# EAGLE board scoutfly_atmel (EAGLE 5.06), part 1 of 3
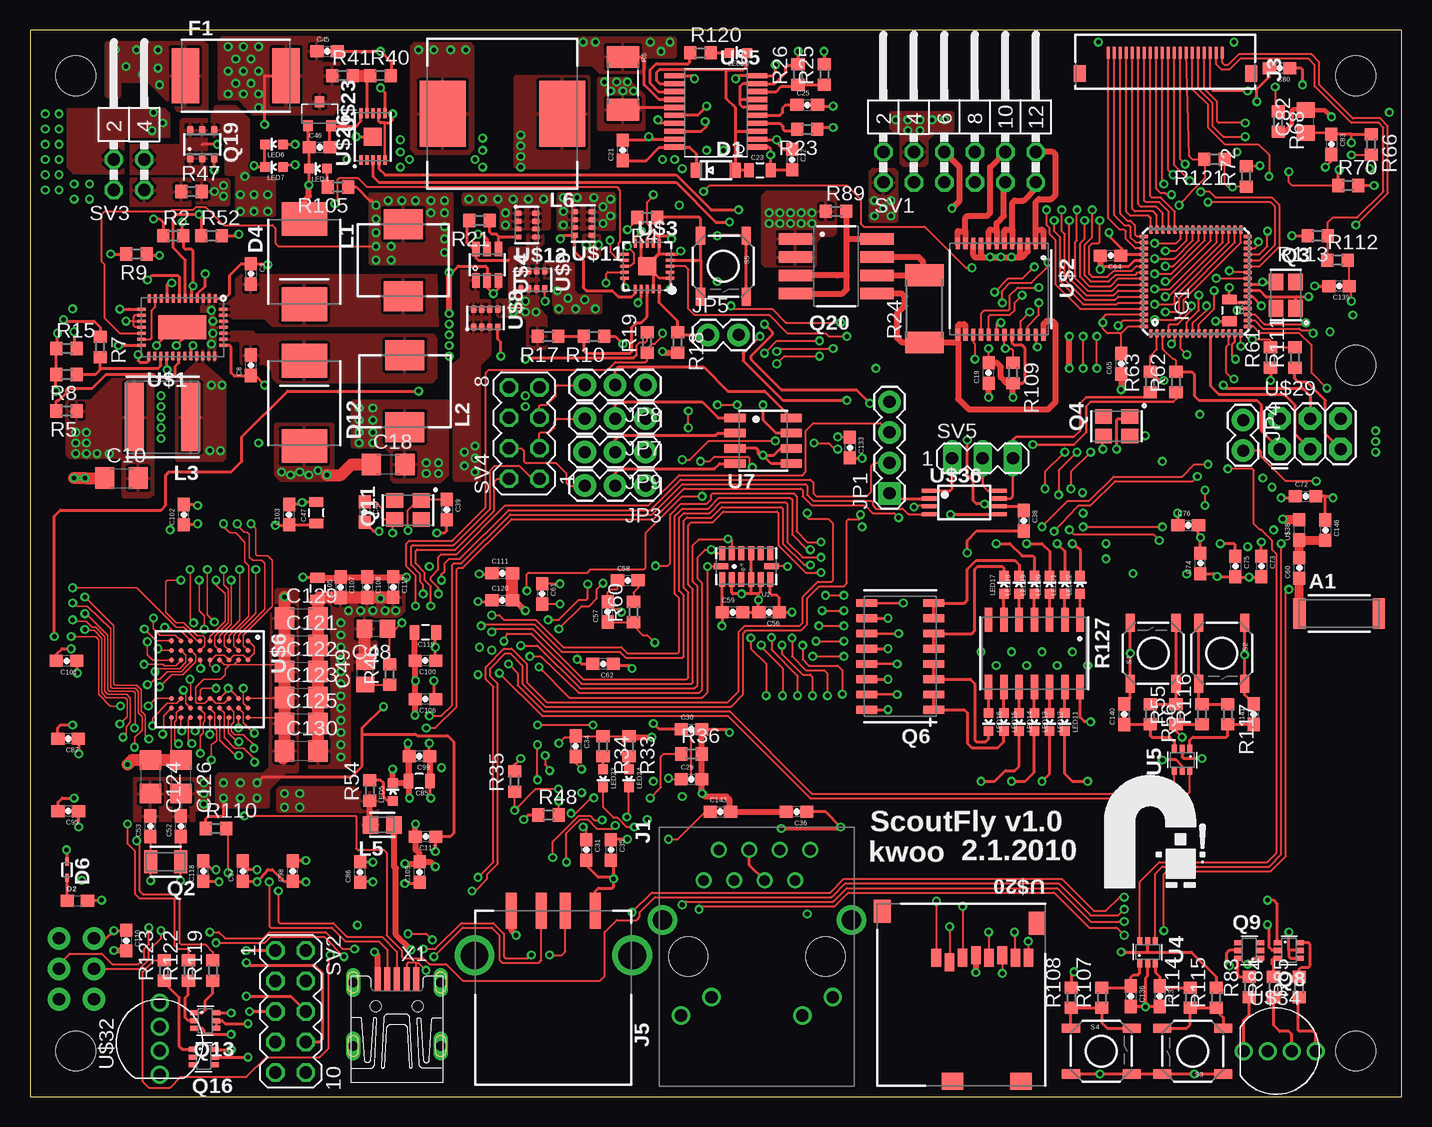
[diagram p7: board, top side]
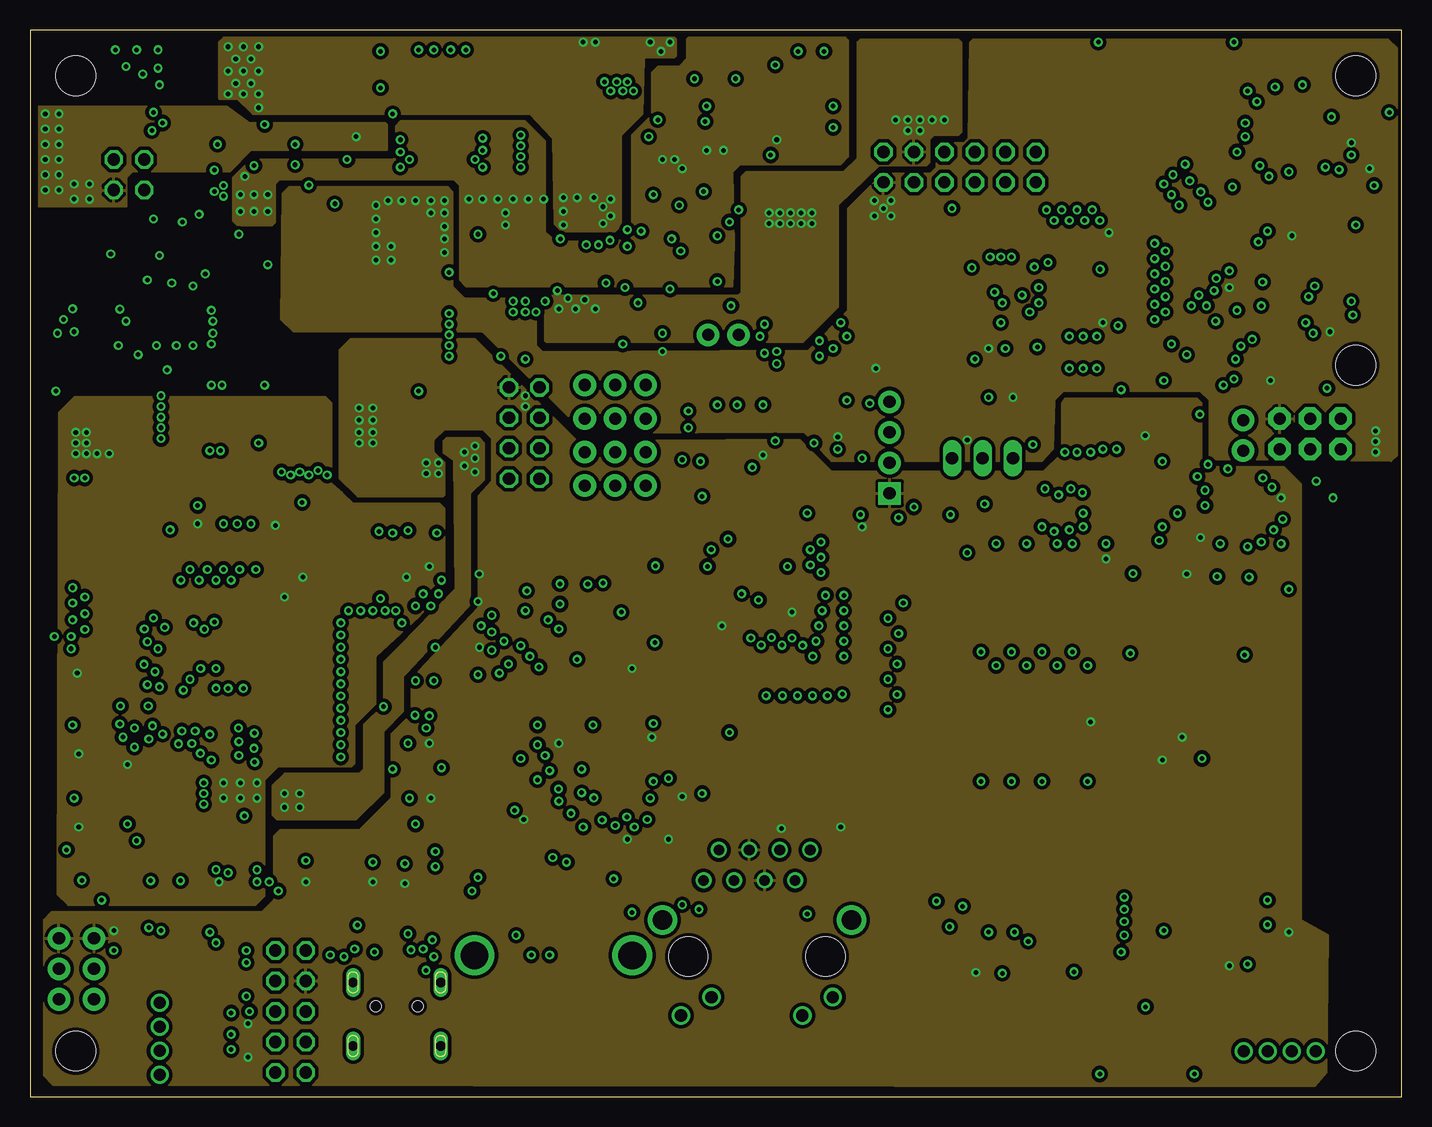
[diagram p8: board, inner layer Power]
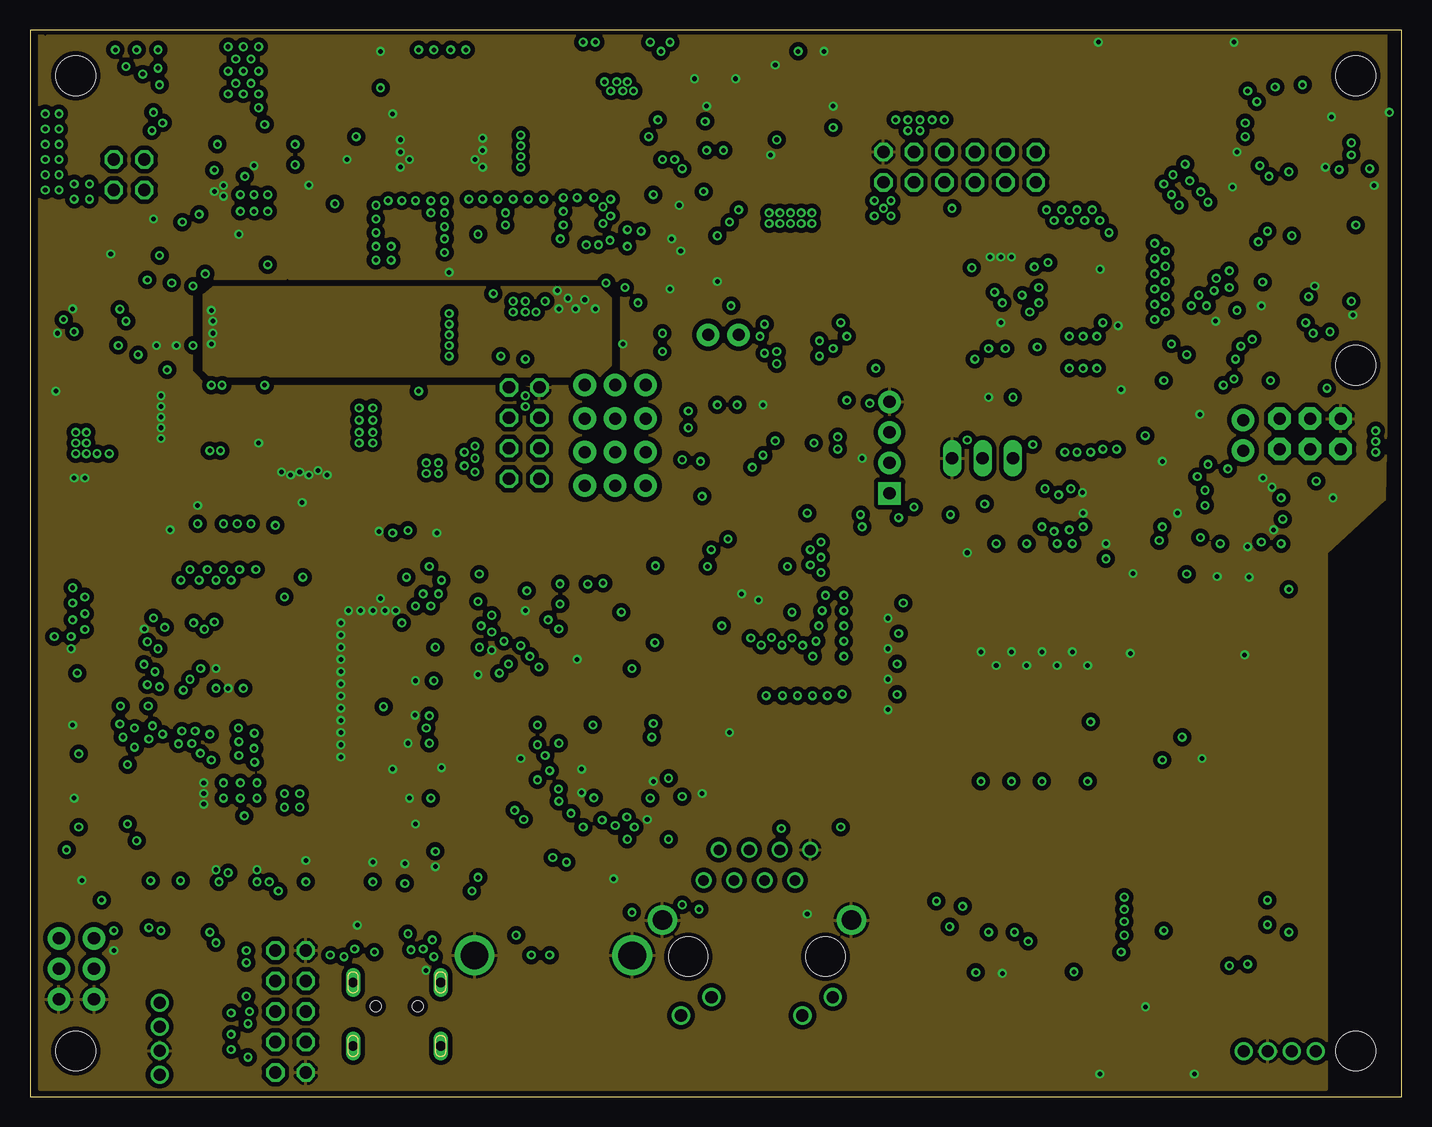
[diagram p9: board, inner layer GND]
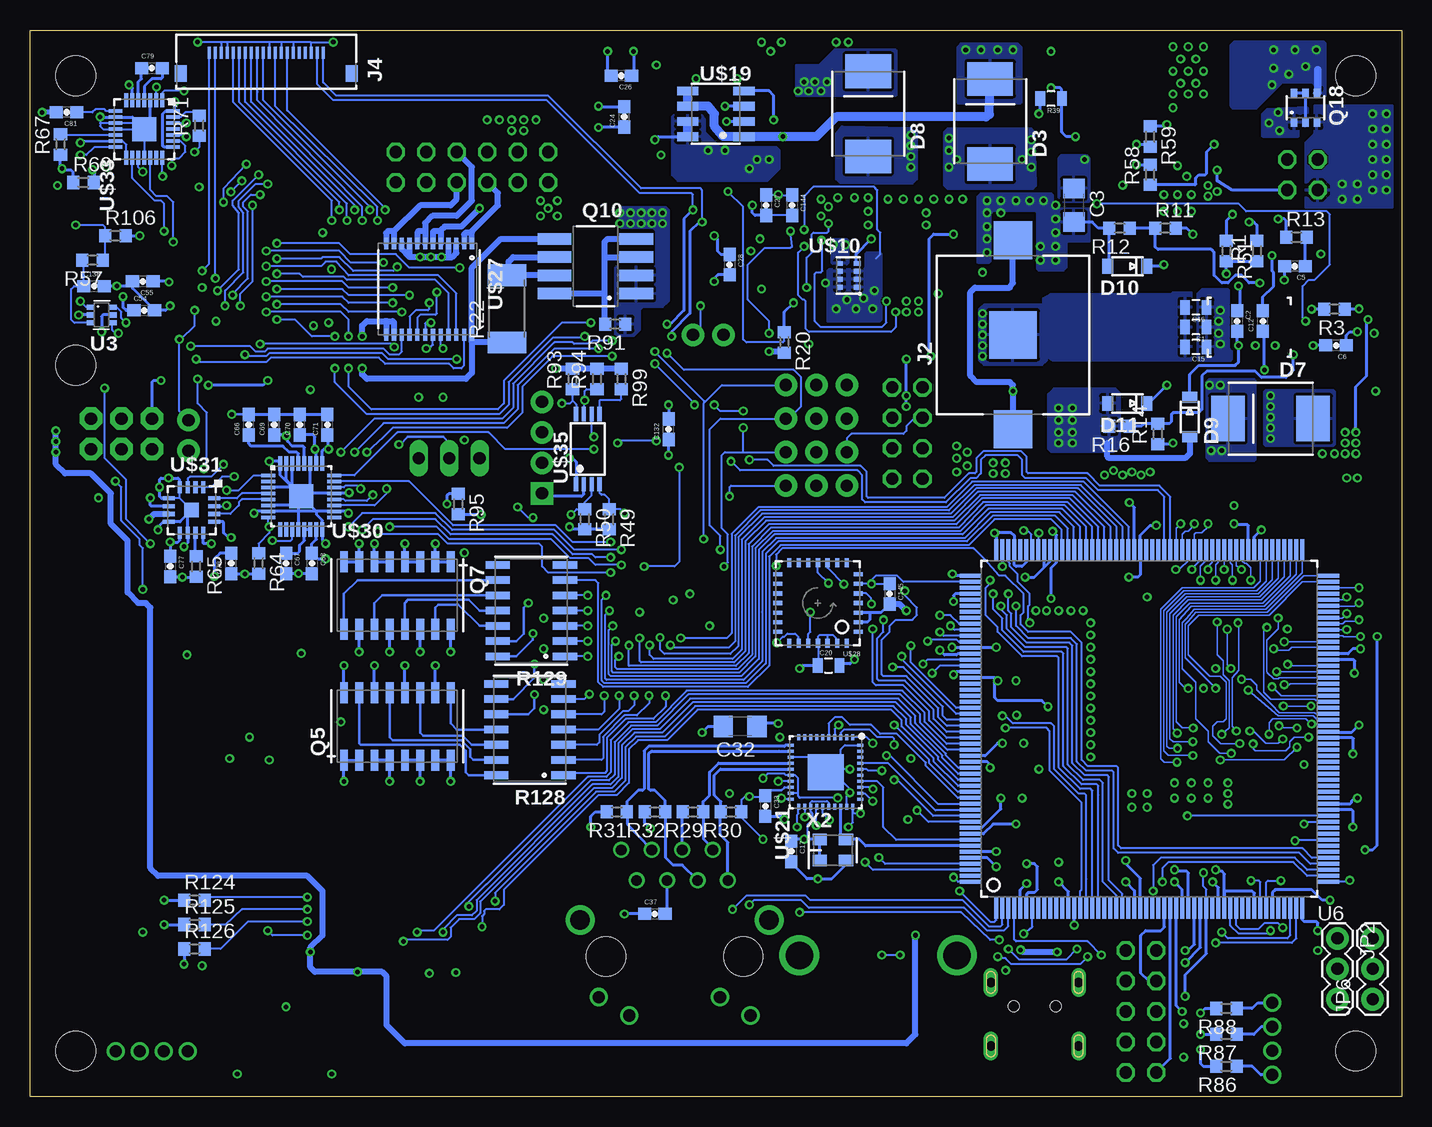
[diagram p10: board, bottom side, seen from below]

Size 114.3 x 88.9 mm. Coordinates in mm from the lower left corner, seen from the top.
Outline: 0,0 114.3,0 114.3,88.9 0,88.9 0,0
Copper layers (1*2+15*16): Top 0.035mm / dielectric 1.5mm / Power 0.035mm / dielectric 0.15mm / GND 0.035mm / dielectric 0.2mm / Bottom 0.035mm
Design rules "advanced_5 *": minimum track width 5mil, minimum drill 15mil, track to track 5mil, track to pad 5mil, pad to pad 5mil, via to via 5mil, smd to smd 5mil, copper to edge 10mil, drill to drill 8mil, minimum pad ring 7mil, minimum via ring 7mil, stop-mask expansion 4mil, vias tented up to drill 0mil, thermal gap 10mil

## Footprints (pad centres in the part's own frame; a part is rotated, then mirrored left to right if it is on the bottom)
CHIP_ANT_2.4GHZ = smd 1.016 x 2.54: 1 -3.302,0; 2 3.302,0
0805 = smd 0.8 x 1.2: 1 -0.9,0; 2 0.9,0
0603-CAP = smd 1.1 x 1: 1 -0.85,0; 2 0.85,0
C1206 = smd 1.6 x 1.8: 1 -1.4,0; 2 1.4,0
C0805 = smd 1.3 x 1.5: 1 -0.95,0; 2 0.95,0
SOD-123 = smd 0.914 x 1.219: 1 -1.638,0; 2 1.638,0
0603 = smd 1.1 x 1: 1 -0.85,0; 2 0.85,0
SMC/DO-214AB = smd 2.8 x 3.8: 1 -3.55,0; 2 3.55,0
SOD523 = smd 0.65 x 0.3: 1 -0.675,0; 2 0.675,0
SM200 = smd 2.3 x 4.6: 1 -4.2,0; 2 4.2,0
MLF64 = smd 0.7 x 0.3: 1 -4.325,3.75; 2 -4.325,3.25; 3 -4.325,2.75; 4 -4.325,2.25; 5 -4.325,1.75; 6 -4.325,1.25; 7 -4.325,0.75; 8 -4.325,0.25; 9 -4.325,-0.25; 10 -4.325,-0.75; 11 -4.325,-1.25; 12 -4.325,-1.75; 13 -4.325,-2.25; 14 -4.325,-2.75; 15 -4.325,-3.25; 16 -4.325,-3.75; 33 4.325,-3.75; 34 4.325,-3.25; 35 4.325,-2.75; 36 4.325,-2.25; 37 4.325,-1.75; 38 4.325,-1.25; 39 4.325,-0.75; 40 4.325,-0.25; 41 4.325,0.25; 42 4.325,0.75; 43 4.325,1.25; 44 4.325,1.75; 45 4.325,2.25; 46 4.325,2.75; 47 4.325,3.25; 48 4.325,3.75 | smd 0.3 x 0.7: 17 -3.75,-4.325; 18 -3.25,-4.325; 19 -2.75,-4.325; 20 -2.25,-4.325; 21 -1.75,-4.325; 22 -1.25,-4.325; 23 -0.75,-4.325; 24 -0.25,-4.325; 25 0.25,-4.325; 26 0.75,-4.325; 27 1.25,-4.325; 28 1.75,-4.325; 29 2.25,-4.325; 30 2.75,-4.325; 31 3.25,-4.325; 32 3.75,-4.325; 49 3.75,4.325; 50 3.25,4.325; 51 2.75,4.325; 52 2.25,4.325; 53 1.75,4.325; 54 1.25,4.325; 55 0.75,4.325; 56 0.25,4.325; 57 -0.25,4.325; 58 -0.75,4.325; 59 -1.25,4.325; 60 -1.75,4.325; 61 -2.25,4.325; 62 -2.75,4.325; 63 -3.25,4.325; 64 -3.75,4.325
RJ45-PULSE = drill 0.889 round: 1 4.445,-6.35; 2 3.175,-8.89; 3 1.905,-6.35; 4 0.635,-8.89; 5 -0.635,-6.35; 6 -1.905,-8.89; 7 -3.175,-6.35; 8 -4.445,-8.89 | drill 1.016 round: 9 6.325,4.902; 10 3.785,3.378; 11 -3.785,4.902; 12 -6.325,3.378 | drill 1.626 round: SHIELD1 -7.874,-3.048; SHIELD2 7.874,-3.048 | hole 3.251: 5.715,0; -5.715,0
COIN_CELL = smd 3.962 x 3.962: NEGATIVE 0,0 | smd 3.175 x 3.175: PLUS1 -7.874,0; PLUS2 7.874,0
OMRON_XF = smd 0.25 x 1: 1 -4.75,0; 2 -4.25,0; 3 -3.75,0; 4 -3.25,0; 5 -2.75,0; 6 -2.25,0; 7 -1.75,0; 8 -1.25,0; 9 -0.75,0; 10 -0.25,0; 11 0.25,0; 12 0.75,0; 13 1.25,0; 14 1.75,0; 15 2.25,0; 16 2.75,0; 17 3.25,0; 18 3.75,0; 19 4.25,0; 20 4.75,0 | smd 1 x 1.34: SOLDER_PAD1 -7.14,-1.72; SOLDER_PAD2 7.14,-1.72
USB_A = smd 0.9 x 3: 1 -3.5,0; 2 -1,0; 3 1,0; 4 3.5,0 | drill 2.3 round: CASE1 -6.57,-3.71; CASE2 6.57,-3.71
1X04 = drill 1.016 pad 1.88 square: 1 0,0 | drill 1.016 pad 1.88 round: 2 2.54,0; 3 5.08,0; 4 7.62,0
1X03 = drill 1.016 pad 1.88 round: 1 0,0; 2 2.54,0; 3 5.08,0
1X02 = drill 1.016 pad 1.88 round: 1 0,0; 2 2.54,0
STAND-OFF = hole 3.302: 0,0
DR74 = smd 2.5 x 3.25: 1 -3,0; 2 3,0
NR6045 = smd 1.6 x 5.7: 1 -2.35,0; 2 2.35,0
0805' = smd 1.285 x 1.47: 1 -0.973,0; 2 0.973,0
DR125 = smd 3.85 x 5.5: 1 -4.975,0; 2 4.975,0
LED-0603 = smd 0.8 x 0.8: A 0,-0.75; C 0,0.75
ECX-31B = smd 1.1 x 1.9: 1 -1.25,0; 2 1.25,0
NX3225SA = smd 1.4 x 1.2: 1 -1.1,-0.8; 2 1.1,-0.8; 3 1.1,0.8; 4 -1.1,0.8
16-SOIC = smd 0.65 x 1.75: 1 -4.445,-2.8; 2 -3.175,-2.8; 3 -1.905,-2.8; 4 -0.635,-2.8; 5 0.635,-2.8; 6 1.905,-2.8; 7 3.175,-2.8; 8 4.445,-2.8; 9 4.445,2.8; 10 3.175,2.8; 11 1.905,2.8; 12 0.635,2.8; 13 -0.635,2.8; 14 -1.905,2.8; 15 -3.175,2.8; 16 -4.445,2.8
SOT363 = smd 0.42 x 0.6: 1 -0.65,-0.95; 2 0,-0.95; 3 0.65,-0.95; 4 0.65,0.95; 5 0,0.95; 6 -0.65,0.95
SOT223-8 = smd 0.95 x 2.8: 1 -2.28,-3.4; 2 -0.76,-3.4; 3 0.76,-3.4; 4 2.28,-3.4; 5 2.28,3.4; 6 0.76,3.4; 7 -0.76,3.4; 8 -2.28,3.4
SOT26 = smd 0.55 x 0.8: 1 -0.95,-1.2; 2 0,-1.2; 3 0.95,-1.2; 4 0.95,1.2; 5 0,1.2; 6 -0.95,1.2
6-TSOP = smd 0.508 x 0.699: 1 -1.001,-1.163; 2 0,-1.163; 3 1.001,-1.163; 4 1.001,1.163; 5 0,1.163; 6 -1.001,1.163
R0603 = smd 1 x 1.1: 1 -0.85,0; 2 0.85,0
R2010 = smd 1.8 x 2.7: 1 -2.2,0; 2 2.2,0
R2512 = smd 1.8 x 3.2: 1 -2.8,0; 2 2.8,0
14-SOIC_CTS = smd 2.03 x 0.63: 1 -2.8,3.81; 2 -2.8,2.54; 3 -2.8,1.27; 4 -2.8,0; 5 -2.8,-1.27; 6 -2.8,-2.54; 7 -2.8,-3.81; 8 2.8,-3.81; 9 2.8,-2.54; 10 2.8,-1.27; 11 2.8,0; 12 2.8,1.27; 13 2.8,2.54; 14 2.8,3.81
TACTILE_SWITCH_SMD = smd 1.524 x 0.762: 1 -2.54,1.905; 2 2.54,1.905; 3 -2.54,-1.905; 4 2.54,-1.905
MA06-2W = drill 1.016 octagon: 1 -7.62,-1.27; 2 -7.62,1.27; 3 -5.08,-1.27; 4 -5.08,1.27; 5 -2.54,-1.27; 6 -2.54,1.27; 7 0,-1.27; 8 0,1.27; 9 2.54,-1.27; 10 2.54,1.27; 11 5.08,-1.27; 12 5.08,1.27
MA05-2 = drill 1.016 octagon: 1 -5.08,-1.27; 2 -5.08,1.27; 3 -2.54,-1.27; 4 -2.54,1.27; 5 0,-1.27; 6 0,1.27; 7 2.54,-1.27; 8 2.54,1.27; 9 5.08,-1.27; 10 5.08,1.27
MA02-2W = drill 1.016 octagon: 1 -1.27,-5.08; 2 -1.27,-2.54; 3 1.27,-5.08; 4 1.27,-2.54
MA04-2 = drill 1.016 octagon: 1 -3.81,-1.27; 2 -3.81,1.27; 3 -1.27,-1.27; 4 -1.27,1.27; 5 1.27,-1.27; 6 1.27,1.27; 7 3.81,-1.27; 8 3.81,1.27
MA03-1 = drill 1.016 long: 1 -2.54,0; 2 0,0; 3 2.54,0
LGA14 = smd 0.5 x 1.2: 1 2,1.1; 2 1.2,1.1; 3 0.4,1.1; 4 -0.4,1.1; 5 -1.2,1.1; 6 -2,1.1; 8 -2,-1.1; 9 -1.2,-1.1; 10 -0.4,-1.1; 11 0.4,-1.1; 12 1.2,-1.1; 13 2,-1.1 | smd 1.2 x 0.5: 7 -2.1,0; 14 2.1,0
208-PQFP = smd 0.35 x 1.77: 1 -12.75,-14.925; 2 -12.25,-14.925; 3 -11.75,-14.925; 4 -11.25,-14.925; 5 -10.75,-14.925; 6 -10.25,-14.925; 7 -9.75,-14.925; 8 -9.25,-14.925; 9 -8.75,-14.925; 10 -8.25,-14.925; 11 -7.75,-14.925; 12 -7.25,-14.925; 13 -6.75,-14.925; 14 -6.25,-14.925; 15 -5.75,-14.925; 16 -5.25,-14.925; 17 -4.75,-14.925; 18 -4.25,-14.925; 19 -3.75,-14.925; 20 -3.25,-14.925; 21 -2.75,-14.925; 22 -2.25,-14.925; 23 -1.75,-14.925; 24 -1.25,-14.925; 25 -0.75,-14.925; 26 -0.25,-14.925; 27 0.25,-14.925; 28 0.75,-14.925; 29 1.25,-14.925; 30 1.75,-14.925; 31 2.25,-14.925; 32 2.75,-14.925; 33 3.25,-14.925; 34 3.75,-14.925; 35 4.25,-14.925; 36 4.75,-14.925; 37 5.25,-14.925; 38 5.75,-14.925; 39 6.25,-14.925; 40 6.75,-14.925; 41 7.25,-14.925; 42 7.75,-14.925; 43 8.25,-14.925; 44 8.75,-14.925; 45 9.25,-14.925; 46 9.75,-14.925; 47 10.25,-14.925; 48 10.75,-14.925; 49 11.25,-14.925; 50 11.75,-14.925; 51 12.25,-14.925; 52 12.75,-14.925; 105 12.75,14.925; 106 12.25,14.925; 107 11.75,14.925; 108 11.25,14.925; 109 10.75,14.925; 110 10.25,14.925; 111 9.75,14.925; 112 9.25,14.925; 113 8.75,14.925; 114 8.25,14.925; 115 7.75,14.925; 116 7.25,14.925; 117 6.75,14.925; 118 6.25,14.925; 119 5.75,14.925; 120 5.25,14.925; 121 4.75,14.925; 122 4.25,14.925; 123 3.75,14.925; 124 3.25,14.925; 125 2.75,14.925; 126 2.25,14.925; 127 1.75,14.925; 128 1.25,14.925; 129 0.75,14.925; 130 0.25,14.925; 131 -0.25,14.925; 132 -0.75,14.925; 133 -1.25,14.925; 134 -1.75,14.925; 135 -2.25,14.925; 136 -2.75,14.925; 137 -3.25,14.925; 138 -3.75,14.925; 139 -4.25,14.925; 140 -4.75,14.925; 141 -5.25,14.925; 142 -5.75,14.925; 143 -6.25,14.925; 144 -6.75,14.925; 145 -7.25,14.925; 146 -7.75,14.925; 147 -8.25,14.925; 148 -8.75,14.925; 149 -9.25,14.925; 150 -9.75,14.925; 151 -10.25,14.925; 152 -10.75,14.925; 153 -11.25,14.925; 154 -11.75,14.925; 155 -12.25,14.925; 156 -12.75,14.925 | smd 1.77 x 0.35: 53 14.925,-12.75; 54 14.925,-12.25; 55 14.925,-11.75; 56 14.925,-11.25; 57 14.925,-10.75; 58 14.925,-10.25; 59 14.925,-9.75; 60 14.925,-9.25; 61 14.925,-8.75; 62 14.925,-8.25; 63 14.925,-7.75; 64 14.925,-7.25; 65 14.925,-6.75; 66 14.925,-6.25; 67 14.925,-5.75; 68 14.925,-5.25; 69 14.925,-4.75; 70 14.925,-4.25; 71 14.925,-3.75; 72 14.925,-3.25; 73 14.925,-2.75; 74 14.925,-2.25; 75 14.925,-1.75; 76 14.925,-1.25; 77 14.925,-0.75; 78 14.925,-0.25; 79 14.925,0.25; 80 14.925,0.75; 81 14.925,1.25; 82 14.925,1.75; 83 14.925,2.25; 84 14.925,2.75; 85 14.925,3.25; 86 14.925,3.75; 87 14.925,4.25; 88 14.925,4.75; 89 14.925,5.25; 90 14.925,5.75; 91 14.925,6.25; 92 14.925,6.75; 93 14.925,7.25; 94 14.925,7.75; 95 14.925,8.25; 96 14.925,8.75; 97 14.925,9.25; 98 14.925,9.75; 99 14.925,10.25; 100 14.925,10.75; 101 14.925,11.25; 102 14.925,11.75; 103 14.925,12.25; 104 14.925,12.75; 157 -14.925,12.75; 158 -14.925,12.25; 159 -14.925,11.75; 160 -14.925,11.25; 161 -14.925,10.75; 162 -14.925,10.25; 163 -14.925,9.75; 164 -14.925,9.25; 165 -14.925,8.75; 166 -14.925,8.25; 167 -14.925,7.75; 168 -14.925,7.25; 169 -14.925,6.75; 170 -14.925,6.25; 171 -14.925,5.75; 172 -14.925,5.25; 173 -14.925,4.75; 174 -14.925,4.25; 175 -14.925,3.75; 176 -14.925,3.25; 177 -14.925,2.75; 178 -14.925,2.25; 179 -14.925,1.75; 180 -14.925,1.25; 181 -14.925,0.75; 182 -14.925,0.25; 183 -14.925,-0.25; 184 -14.925,-0.75; 185 -14.925,-1.25; 186 -14.925,-1.75; 187 -14.925,-2.25; 188 -14.925,-2.75; 189 -14.925,-3.25; 190 -14.925,-3.75; 191 -14.925,-4.25; 192 -14.925,-4.75; 193 -14.925,-5.25; 194 -14.925,-5.75; 195 -14.925,-6.25; 196 -14.925,-6.75; 197 -14.925,-7.25; 198 -14.925,-7.75; 199 -14.925,-8.25; 200 -14.925,-8.75; 201 -14.925,-9.25; 202 -14.925,-9.75; 203 -14.925,-10.25; 204 -14.925,-10.75; 205 -14.925,-11.25; 206 -14.925,-11.75; 207 -14.925,-12.25; 208 -14.925,-12.75
8-SOIC = smd 0.72 x 1.78: 1 -1.905,-2.34; 2 -0.635,-2.34; 3 0.635,-2.34; 4 1.905,-2.34; 5 1.905,2.34; 6 0.635,2.34; 7 -0.635,2.34; 8 -1.905,2.34
38-QFN = smd 0.7 x 0.25: 1 -2.4,2.75; 2 -2.4,2.25; 3 -2.4,1.75; 4 -2.4,1.25; 5 -2.4,0.75; 6 -2.4,0.25; 7 -2.4,-0.25; 8 -2.4,-0.75; 9 -2.4,-1.25; 10 -2.4,-1.75; 11 -2.4,-2.25; 12 -2.4,-2.75; 20 2.4,-2.8; 21 2.4,-2.3; 22 2.4,-1.8; 23 2.4,-1.3; 24 2.4,-0.8; 25 2.4,-0.3; 26 2.4,0.2; 27 2.4,0.7; 28 2.4,1.2; 29 2.4,1.7; 30 2.4,2.2; 31 2.4,2.7 | smd 0.25 x 0.7: 13 -1.5,-3.4; 14 -1,-3.4; 15 -0.5,-3.4; 16 0,-3.4; 17 0.5,-3.4; 18 1,-3.4; 19 1.5,-3.4; 32 1.5,3.4; 33 1,3.4; 34 0.5,3.4; 35 0,3.4; 36 -0.5,3.4; 37 -1,3.4; 38 -1.5,3.4 | smd 2 x 4: 39 0,0
24-SSOP = smd 0.35 x 0.97: 1 0,-3.81; 2 0.65,-3.81; 3 1.3,-3.81; 4 1.95,-3.81; 5 2.6,-3.81; 6 3.25,-3.81; 7 3.9,-3.81; 8 4.55,-3.81; 9 5.2,-3.81; 10 5.85,-3.81; 11 6.5,-3.81; 12 7.15,-3.81; 13 7.15,3.81; 14 6.5,3.81; 15 5.85,3.81; 16 5.2,3.81; 17 4.55,3.81; 18 3.9,3.81; 19 3.25,3.81; 20 2.6,3.81; 21 1.95,3.81; 22 1.3,3.81; 23 0.65,3.81; 24 0,3.81
20-QFN = smd 0.7 x 0.25: 1 -1.9,1; 2 -1.9,0.5; 3 -1.9,0; 4 -1.9,-0.5; 5 -1.9,-1; 11 1.9,-1; 12 1.9,-0.5; 13 1.9,0; 14 1.9,0.5; 15 1.9,1 | smd 0.25 x 0.7: 6 -1,-1.9; 7 -0.5,-1.9; 8 0,-1.9; 9 0.5,-1.9; 10 1,-1.9; 16 1,1.9; 17 0.5,1.9; 18 0,1.9; 19 -0.5,1.9; 20 -1,1.9 | smd 1.5 x 1.5: 21 0,0
6-TSOT23 = smd 0.62 x 1.22: 1 -0.95,-1.31; 2 0,-1.31; 3 0.95,-1.31; 4 0.95,1.31; 5 0,1.31; 6 -0.95,1.31
20-SSOP = smd 1.651 x 0.432: 1 -3.48,5.944; 2 -3.48,5.283; 3 -3.48,4.623; 4 -3.48,3.962; 5 -3.48,3.302; 6 -3.48,2.642; 7 -3.48,1.981; 8 -3.48,1.321; 9 -3.48,0.66; 10 -3.48,0; 11 3.48,0; 12 3.48,0.66; 13 3.48,1.321; 14 3.48,1.981; 15 3.48,2.642; 16 3.48,3.302; 17 3.48,3.962; 18 3.48,4.623; 19 3.48,5.283; 20 3.48,5.944
54-VFBGA = smd 0.4 x 0.4: A1 -3.2,3.2; A2 -2.4,3.2; A3 -1.6,3.2; A7 1.6,3.2; A8 2.4,3.2; A9 3.2,3.2; B1 -3.2,2.4; B2 -2.4,2.4; B3 -1.6,2.4; B7 1.6,2.4; B8 2.4,2.4; B9 3.2,2.4; C1 -3.2,1.6; C2 -2.4,1.6; C3 -1.6,1.6; C7 1.6,1.6; C8 2.4,1.6; C9 3.2,1.6; D1 -3.2,0.8; D2 -2.4,0.8; D3 -1.6,0.8; D7 1.6,0.8; D8 2.4,0.8; D9 3.2,0.8; E1 -3.2,0; E2 -2.4,0; E3 -1.6,0; E7 1.6,0; E8 2.4,0; E9 3.2,0; F1 -3.2,-0.8; F2 -2.4,-0.8; F3 -1.6,-0.8; F4 1.6,-0.8; F5 2.4,-0.8; F6 3.2,-0.8; G1 -3.2,-1.6; G2 -2.4,-1.6; G3 -1.6,-1.6; G4 1.6,-1.6; G5 2.4,-1.6; G6 3.2,-1.6; H1 -3.2,-2.4; H2 -2.4,-2.4; H3 -1.6,-2.4; H7 1.6,-2.4; H8 2.4,-2.4; H9 3.2,-2.4; J2 -2.4,-3.2; J3 -1.6,-3.2; J7 1.6,-3.2; J8 2.4,-3.2; J9 3.2,-3.2 | smd 0.45 x 0.4: J1 -3.2,-3.2
1206-8_CHIPFET = smd 0.406 x 0.559: 1 -0.991,-0.737; 2 -0.33,-0.737; 3 0.33,-0.737; 4 0.991,-0.737; 5 0.991,0.737; 6 0.33,0.737; 7 -0.33,0.737; 8 -0.991,0.737
MICRO_SD = smd 0.8 x 1.5: 1 -9.1,10.7; 2 -8,10.3; 3 -6.9,10.7; 4 -5.8,10.9; 5 -4.7,10.7; 6 -3.6,10.9; 7 -2.5,10.7; 8 -1.4,10.7 | smd 1.4 x 1.9: P$9 -13.6,14.55; P$12 -0.7,13.55 | smd 1.8 x 1.4: P$10 -7.75,0.4; P$11 -2.05,0.4
40-LLP = smd 0.5 x 0.25: 1 -2.9,2.25; 2 -2.9,1.75; 3 -2.9,1.25; 4 -2.9,0.75; 5 -2.9,0.25; 6 -2.9,-0.25; 7 -2.9,-0.75; 8 -2.9,-1.25; 9 -2.9,-1.75; 10 -2.9,-2.25; 21 2.9,-2.25; 22 2.9,-1.75; 23 2.9,-1.25; 24 2.9,-0.75; 25 2.9,-0.25; 26 2.9,0.25; 27 2.9,0.75; 28 2.9,1.25; 29 2.9,1.75; 30 2.9,2.25 | smd 0.25 x 0.5: 11 -2.25,-2.9; 12 -1.75,-2.9; 13 -1.25,-2.9; 14 -0.75,-2.9; 15 -0.25,-2.9; 16 0.25,-2.9; 17 0.75,-2.9; 18 1.25,-2.9; 19 1.75,-2.9; 20 2.25,-2.9; 31 2.25,2.9; 32 1.75,2.9; 33 1.25,2.9; 34 0.75,2.9; 35 0.25,2.9; 36 -0.25,2.9; 37 -0.75,2.9; 38 -1.25,2.9; 39 -1.75,2.9; 40 -2.25,2.9 | smd 3 x 3: 41 0,0
SOT23 = smd 0.8 x 0.9: 1 -0.95,-1; 2 0.95,-1; 3 0,1
10-TDFN = smd 0.805 x 0.3: 1 -1.952,1; 2 -1.952,0.5; 3 -1.952,0; 4 -1.952,-0.5; 5 -1.952,-1; 6 1.952,-1; 7 1.952,-0.5; 8 1.952,0; 9 1.952,0.5; 10 1.952,1 | smd 1.5 x 1.5: 11 0,0
LGA28 = smd 0.75 x 0.35: 1 -3.35,2.4; 2 -3.35,1.6; 3 -3.35,0.8; 4 -3.35,0; 5 -3.35,-0.8; 6 -3.35,-1.6; 7 -3.35,-2.4; 15 3.35,-2.4; 16 3.35,-1.6; 17 3.35,-0.8; 18 3.35,0; 19 3.35,0.8; 20 3.35,1.6; 21 3.35,2.4 | smd 0.35 x 0.75: 8 -2.4,-3.35; 9 -1.6,-3.35; 10 -0.8,-3.35; 11 0,-3.35; 12 0.8,-3.35; 13 1.6,-3.35; 14 2.4,-3.35; 22 2.4,3.35; 23 1.6,3.35; 24 0.8,3.35; 25 0,3.35; 26 -0.8,3.35; 27 -1.6,3.35; 28 -2.4,3.35
2X3 = drill 1.016 pad 1.88 octagon: 1 0,0; 2 0,2.54; 3 2.54,0; 4 2.54,2.54; 5 5.08,0; 6 5.08,2.54
32-QFN = smd 1.2 x 0.3: 1 -2.75,1.75; 2 -2.75,1.25; 3 -2.75,0.75; 4 -2.75,0.25; 5 -2.75,-0.25; 6 -2.75,-0.75; 7 -2.75,-1.25; 8 -2.75,-1.75; 17 2.75,-1.75; 18 2.75,-1.25; 19 2.75,-0.75; 20 2.75,-0.25; 21 2.75,0.25; 22 2.75,0.75; 23 2.75,1.25; 24 2.75,1.75 | smd 0.3 x 1.2: 9 -1.75,-2.75; 10 -1.25,-2.75; 11 -0.75,-2.75; 12 -0.25,-2.75; 13 0.25,-2.75; 14 0.75,-2.75; 15 1.25,-2.75; 16 1.75,-2.75; 25 1.75,2.75; 26 1.25,2.75; 27 0.75,2.75; 28 0.25,2.75; 29 -0.25,2.75; 30 -0.75,2.75; 31 -1.25,2.75; 32 -1.75,2.75 | smd 2 x 2: 33 0,0
16-QFN = smd 1 x 0.35: 1 -1.9,0.975; 2 -1.9,0.325; 3 -1.9,-0.325; 4 -1.9,-0.975; 9 1.9,-0.975; 10 1.9,-0.325; 11 1.9,0.325; 12 1.9,0.975 | smd 0.35 x 1: 5 -0.975,-1.9; 6 -0.325,-1.9; 7 0.325,-1.9; 8 0.975,-1.9; 13 0.975,1.9; 14 0.325,1.9; 15 -0.325,1.9; 16 -0.975,1.9 | smd 1.2 x 1.2: 17 0,0
LED-TRICOLOR-THROUGHHOLE = drill 1 round: BLU 1,0; GND -1,0; GRN 3,0; RED -3,0
28-QFN = smd 1.15 x 0.3: 1 -2.4,1.5; 2 -2.4,1; 3 -2.4,0.5; 4 -2.4,0; 5 -2.4,-0.5; 6 -2.4,-1; 7 -2.4,-1.5; 15 2.4,-1.5; 16 2.4,-1; 17 2.4,-0.5; 18 2.4,0; 19 2.4,0.5; 20 2.4,1; 21 2.4,1.5 | smd 0.3 x 1.15: 8 -1.5,-2.4; 9 -1,-2.4; 10 -0.5,-2.4; 11 0,-2.4; 12 0.5,-2.4; 13 1,-2.4; 14 1.5,-2.4; 22 1.5,2.4; 23 1,2.4; 24 0.5,2.4; 25 0,2.4; 26 -0.5,2.4; 27 -1,2.4; 28 -1.5,2.4 | smd 2 x 2: 29 0,0
TSSOP8 = smd 1.2 x 0.35: 1 -2.925,0.975; 2 -2.925,0.325; 3 -2.925,-0.325; 4 -2.925,-0.975; 5 2.925,-0.975; 6 2.925,-0.325; 7 2.925,0.325; 8 2.925,0.975
UX60-MB-5S8 = smd 2 x 0.5: 1 8.65,1.6; 2 8.65,0.8; 3 8.65,0; 4 8.65,-0.8; 5 8.65,-1.6 | drill 0.8 long: M1 3.1,-3.65; M2 3.1,3.65; M3 8.4,3.65; M4 8.4,-3.65 | hole 0.9: 6.4,-1.75; 6.4,1.75
K25-3C = smd 1.2 x 0.95: 1 -1.1,-0.875; 2 1.1,-0.875; 3 1.1,0.875; 4 -1.1,0.875

## Placement (x,y rotation side)
A1  ANT-2.4-CHP  [CHIP_ANT_2.4GHZ]  109.09,40.26 0 top
C1  10uF  [0805]  17.14,64.14 180 bottom
C2  0.1uF  [0603-CAP]  13.72,64.64 270 bottom
C3  15uF  [C1206]  27.3,74.3 270 bottom
C5  1000pF  [0603-CAP]  8.89,69.22 180 bottom
C6  2000pF  [0603-CAP]  5.46,62.61 180 bottom
C8  0.1uF  [0603-CAP]  18.41,60.96 90 top
C9  0.1uF  [0603-CAP]  18.41,68.58 270 top
C10  47uF  [C1206]  7.62,51.56 0 top
C12  1000pF  [0603-CAP]  11.56,64.64 90 bottom
C15  10uF  [0805]  17.14,62.48 180 bottom
C16  10uF  [0805]  17.14,65.79 180 bottom
C17  0.01uF  [0603-CAP]  50.87,20.45 270 bottom
C18  15uF  [C1206]  29.84,52.7 0 top
C19  0.1uF  [0603-CAP]  79.88,60.33 90 top
C20  10uF  [0805]  47.75,35.94 0 bottom
C21  0.1uF  [0603-CAP]  49.4,78.87 90 top
C22  0.1uF  [0603-CAP]  63.5,78.11 270 top
C23  4.7uF  [0805]  60.83,77.22 0 top
C24  0.1uF  [0603-CAP]  64.77,81.66 90 bottom
C25  0.047uF  [0603-CAP]  64.77,82.65 0 top
C26  0.1uF  [0603-CAP]  65.02,85.09 180 bottom
C27  0.1uF  [0603-CAP]  52.96,74.3 270 bottom
C28  0.1uF  [0603-CAP]  56.01,69.34 270 bottom
C29  0.1uF  [0603-CAP]  55.12,26.47 0 top
C30  0.1uF  [0603-CAP]  55.12,30.63 0 top
C31  0.1uF  [0603-CAP]  46.35,20.57 270 top
C32  10uF  [C1206]  55.12,30.86 180 bottom
C33  0.1uF  [0603-CAP]  53.01,24.23 270 bottom
C34  0.1uF  [0603-CAP]  45.47,29.21 270 top
C35  0.1uF  [0603-CAP]  48.41,20.57 270 top
C36  0.1uF  [0603-CAP]  63.88,23.75 180 top
C37  0.1uF  [0603-CAP]  62.23,15.24 0 bottom
C38  0.1uF  [0603-CAP]  82.8,48.01 270 top
C39  18pF  [0603-CAP]  34.74,48.93 270 top
C40  18pF  [0603-CAP]  27.88,48.73 270 top
C45  1uF  [0603-CAP]  24.77,87.12 0 top
C46  1uF  [0603-CAP]  24.13,79.12 0 top
C47  10uF  [0805]  23.86,48.67 90 top
C48  1.77nF  [C0805]  28.83,38.99 180 top
C49  17.7nF  [C0805]  27.94,35.31 90 top
C52  18pF  [0603-CAP]  12.57,22.55 90 top
C53  18pF  [0603-CAP]  10.03,22.54 90 top
C54  18pF  [0603-CAP]  104.78,65.53 0 bottom
C55  18pF  [0603-CAP]  104.9,67.94 180 bottom
C56  0.1uF  [0603-CAP]  61.59,40.39 180 top
C57  0.01uF  [0603-CAP]  48.13,40.41 90 top
C58  0.47uF  [0603-CAP]  49.81,43.03 0 top
C59  0.1uF  [0603-CAP]  58.55,40.39 0 top
C60  1000pF  [0603-CAP]  105.79,44.07 90 top
C61  0.01uF  [0603-CAP]  42.67,41.91 270 top
C62  0.1uF  [0603-CAP]  47.75,36.07 180 top
C63  10uF  [0805]  99.95,65.53 270 top
C64  0.1uF  [0603-CAP]  90.04,70.1 180 top
C65  0.1uF  [0603-CAP]  90.93,61.09 90 top
C66  1uF  [0603-CAP]  96.06,56.01 90 bottom
C67  1uF  [0603-CAP]  92.96,44.45 270 bottom
C68  1uF  [0603-CAP]  90.81,44.45 270 bottom
C69  1uF  [0603-CAP]  93.95,56.01 90 bottom
C70  18pF  [0603-CAP]  91.82,56.01 90 bottom
C71  18pF  [0603-CAP]  89.51,56.01 90 bottom
C72  10pF  [0603-CAP]  106.3,50.04 0 top
C73  10pF  [0603-CAP]  102.62,44.2 270 top
C74  1000pF  [0603-CAP]  97.54,44.45 90 top
C75  1000pF  [0603-CAP]  100.46,44.2 270 top
C76  18pF  [0603-CAP]  96.52,47.62 0 top
C77  1000pF  [0603-CAP]  102.62,44.2 270 bottom
C78  1000pF  [0603-CAP]  97.54,44.45 90 bottom
C79  0.1uF  [0603-CAP]  104.14,85.72 0 bottom
C80  0.1uF  [0603-CAP]  104.14,85.72 180 top
C81  0.22uF  [0603-CAP]  111.25,82.04 180 bottom
C82  4.7uF  [C0805]  106.3,81.28 90 top
C83  1uF  [0603-CAP]  108.46,79.38 270 top
C85  10uF  [0805]  32.44,26.31 180 top
C86  0.1uF  [0603-CAP]  27.51,18.73 90 top
C87  0.1uF  [0603-CAP]  3.17,29.84 180 top
C95  0.1uF  [0603-CAP]  3.19,23.81 180 top
C97  0.01uF  [0603-CAP]  17.74,18.8 90 top
C98  0.1uF  [0603-CAP]  21.9,18.8 90 top
C99  0.1uF  [0603-CAP]  32.45,28.39 180 top
C100  0.1uF  [0603-CAP]  32.95,36.35 180 top
C101  0.1uF  [0603-CAP]  3.05,36.32 180 top
C102  0.1uF  [0603-CAP]  12.83,48.51 90 top
C103  0.1uF  [0603-CAP]  21.59,48.51 90 top
C105  10uF  [0805]  23.97,42.35 270 top
C106  0.1uF  [0603-CAP]  32.95,33.14 180 top
C107  0.1uF  [0603-CAP]  25.88,42.46 270 top
C108  0.1uF  [0603-CAP]  28.09,42.46 270 top
C109  0.1uF  [0603-CAP]  32.47,18.73 90 top
C110  0.1uF  [0603-CAP]  8.02,13.02 270 top
C111  0.1uF  [0603-CAP]  39.35,43.64 0 top
C112  0.1uF  [0603-CAP]  30.27,42.48 270 top
C117  0.1uF  [0603-CAP]  32.96,21.69 180 top
C118  0.1uF  [0603-CAP]  14.46,18.8 90 top
C119  10uF  [0805]  32.96,38.7 180 top
C120  0.01uF  [0603-CAP]  39.36,41.38 0 top
C121  0.1uF  [C1206]  22.61,37.62 0 top
C122  0.1uF  [C1206]  22.61,35.43 0 top
C123  0.1uF  [C1206]  22.61,33.27 0 top
C124  0.1uF  [C1206]  10.03,26.67 270 top
C125  0.1uF  [C1206]  22.61,31.11 0 top
C126  0.1uF  [C1206]  12.57,26.67 270 top
C129  0.22uF  [C1206]  22.61,39.88 0 top
C130  0.22uF  [C1206]  22.61,28.83 0 top
C132  0.1uF  [0603-CAP]  61.09,55.63 90 bottom
C133  0.1uF  [0603-CAP]  68.33,54.1 270 top
C136  1uF  [0603-CAP]  91.73,8.38 270 top
C137  1uF  [0603-CAP]  94.15,8.38 270 top
C138  1uF  [0603-CAP]  108.97,67.56 0 bottom
C139  1uF  [0603-CAP]  109.09,67.56 180 top
C140  1uF  [0603-CAP]  91.19,31.88 90 top
C141  1uF  [0603-CAP]  101.98,31.88 90 top
C143  0.1uF  [0603-CAP]  57.53,23.75 0 top
C144  0.1uF  [0603-CAP]  50.8,74.3 270 bottom
C145  430pF  [0603-CAP]  42.67,41.91 270 bottom
C146  1pF  [0603-CAP]  107.95,47.22 270 top
D1  1N41482  [SOD-123]  57.15,77.22 180 top
D2  CDSU101A  [0603]  3.95,16.33 0 top
D3  MBRS340  [SMC/DO-214AB]  34.29,81.28 90 bottom
D4  MBRS340  [SMC/DO-214AB]  22.86,69.6 270 top
D6  BAS69KFILM  [SOD523]  3.1,18.92 270 top
D7  MBRS340  [SMC/DO-214AB]  10.92,56.52 180 bottom
D8  MBRS340  [SMC/DO-214AB]  44.45,81.92 90 bottom
D9  1N41482  [SOD-123]  17.65,56.64 90 bottom
D10  1N41482  [SOD-123]  22.86,69.22 0 bottom
D11  1N41482  [SOD-123]  22.86,57.78 0 bottom
D12  MBRS340  [SMC/DO-214AB]  22.86,57.78 90 top
F1  [SM200]  17.14,85.09 0 top
IC1  MEGA128-M  [MLF64]  97.16,67.94 90 top
J1  RJ45_PULSE  [RJ45-PULSE]  60.58,11.68 180 top
J2  KEYSTONE_3000  [COIN_CELL]  32.38,63.5 270 bottom
J3  XF2L  [OMRON_XF]  94.61,87 0 top
J4  XF2L  [OMRON_XF]  94.61,87 0 bottom
J5  USB_A  [USB_A]  43.61,15.5 0 top
JP1  [1X04]  71.63,50.29 90 top
JP2  JUMPER-3PTH  [1X03]  5.33,13.21 270 bottom
JP3  [1X03]  51.31,50.93 180 top
JP4  [1X02]  101.09,56.39 270 top
JP5  [1X02]  56.52,63.5 0 top
JP6  JUMPER-3PTH  [1X03]  2.41,8.13 90 bottom
JP7  [1X03]  51.31,56.52 180 top
JP8  [1X03]  51.31,59.31 180 top
JP9  [1X03]  51.31,53.72 180 top
JP10  STAND-OFF  [STAND-OFF]  3.81,3.81 0 top
JP11  STAND-OFF  [STAND-OFF]  3.81,85.09 0 top
JP12  STAND-OFF  [STAND-OFF]  110.49,3.81 0 top
JP13  STAND-OFF  [STAND-OFF]  110.49,85.09 0 top
JP14  STAND-OFF  [STAND-OFF]  110.49,60.96 0 top
L1  4.7uH  [DR74]  31.11,69.72 270 top
L2  4.7uH  [DR74]  31.24,58.8 90 top
L3  3uH  [NR6045]  11.05,56.64 180 top
L5  MI0805K400R-10  [0805']  29.36,22.66 0 top
L6  22uH  [DR125]  39.37,81.92 180 top
LED4  Blue  [LED-0603]  24,77.34 90 top
LED5  Blue  [LED-0603]  30.23,25.4 0 top
LED6  Blue  [LED-0603]  20.32,79.38 90 top
LED7  Blue  [LED-0603]  20.32,77.47 90 top
LED10  Blue  [LED-0603]  59.05,87 90 top
LED11  Green  [LED-0603]  86.23,31.24 180 top
LED12  Green  [LED-0603]  84.96,31.24 180 top
LED13  Green  [LED-0603]  83.69,31.24 180 top
LED14  Green  [LED-0603]  82.42,31.24 180 top
LED15  Green  [LED-0603]  81.15,31.24 180 top
LED16  Green  [LED-0603]  79.88,31.24 180 top
LED17  Red  [LED-0603]  81.15,42.67 0 top
LED18  Red  [LED-0603]  82.42,42.67 0 top
LED19  Red  [LED-0603]  83.69,42.67 0 top
LED20  Red  [LED-0603]  84.96,42.67 0 top
LED21  Red  [LED-0603]  86.23,42.67 0 top
LED22  Red  [LED-0603]  87.5,42.67 0 top
LED23  Green  [LED-0603]  47.75,26.54 180 top
LED24  Green  [LED-0603]  49.91,26.54 180 top
Q2  32.768kHz  [ECX-31B]  11.3,19.58 180 top
Q3  16MHz  [NX3225SA]  104.65,66.8 90 top
Q4  16MHz  [NX3225SA]  90.55,55.88 180 top
Q5  MMPQ3904  [16-SOIC]  83.69,30.86 0 bottom
Q6  MMPQ3904  [16-SOIC]  72.52,36.7 90 top
Q7  MMPQ3904  [16-SOIC]  83.69,41.78 180 bottom
Q8  DMMT3906W  [SOT363]  104.9,12.19 270 top
Q9  DMMT3906W  [SOT363]  101.6,12.19 90 top
Q10  ZDT1053  [SOT223-8]  67.18,69.22 90 bottom
Q11  16MHz  [NX3225SA]  31.49,48.9 180 top
Q13  DMMT3906W  [SOT363]  14.61,6.35 270 top
Q16  DMMT3906W  [SOT363]  14.48,3.3 270 top
Q18  DMP266LDM  [SOT26]  8,82.42 0 bottom
Q19  SI3493BDV  [6-TSOP]  14.35,79.38 0 top
Q20  ZDT1053  [SOT223-8]  67.18,69.22 270 top
R1  10K  [R0603]  12.06,70.48 90 bottom
R2  1.1K  [R0603]  11.94,71.75 0 top
R3  34K  [R0603]  5.59,65.63 180 bottom
R4  10K  [R0603]  51.44,73.28 180 top
R5  10K  [R0603]  3.05,57.15 180 top
R6  0.1, 1W  [R2010]  49.4,84.45 270 top
R7  1.02K  [R0603]  5.84,62.48 270 top
R8  806  [R0603]  3.05,60.2 180 top
R9  13.3K  [R0603]  8.89,70.23 180 top
R10  1.07K  [R0603]  46.99,63.37 180 top
R11  953  [R0603]  19.68,72.39 0 bottom
R12  4.99K  [R0603]  23.5,72.39 180 bottom
R13  16.2K  [R0603]  8.76,71.63 0 bottom
R14  1.07K  [R0603]  20.32,55.24 90 bottom
R15  7.32K  [R0603]  3.05,62.36 0 top
R16  3.32K  [R0603]  23.5,55.88 180 bottom
R17  1.07K  [R0603]  43.18,63.37 180 top
R18  10K  [R0603]  53.98,62.87 270 top
R19  10K  [R0603]  51.44,62.87 90 top
R20  10K  [R0603]  51.44,62.87 270 bottom
R21  470K  [R0603]  37.47,73.03 180 top
R22  0.5, 2W  [R2512]  74.55,65.66 90 bottom
R23  10K  [R0603]  64.77,80.62 180 top
R24  0.5, 2W  [R2512]  74.55,65.66 90 top
R25  100K  [R0603]  66.19,85.19 90 top
R26  49.9K  [R0603]  64.01,85.19 90 top
R29  49.9  [R0603]  59.05,23.75 180 bottom
R30  49.9  [R0603]  55.88,23.75 180 bottom
R31  49.9  [R0603]  65.41,23.75 180 bottom
R32  49.9  [R0603]  62.23,23.75 180 bottom
R33  60.4  [R0603]  49.91,29.21 270 top
R34  60.4  [R0603]  47.75,29.21 270 top
R35  2.2K  [R0603]  40.39,26.29 90 top
R36  4.87K  [R0603]  55.12,28.57 0 top
R39  0.01, 1%, 1/4W  [0805]  29.21,83.19 180 bottom
R40  49.9K  [R0603]  29.21,85.09 0 top
R41  49.9K  [R0603]  26.04,85.09 0 top
R46  549  [R0603]  29.97,35.2 90 top
R47  0  [R0603]  13.46,75.44 0 top
R48  2.2K  [R0603]  43.22,23.48 0 top
R49  976  [R0603]  66.04,48.13 270 bottom
R50  976  [R0603]  68.07,48.13 270 bottom
R51  3.9K  [R0603]  14.61,70.48 270 bottom
R52  910  [R0603]  15.11,71.75 0 top
R54  84.5  [R0603]  28.32,25.53 90 top
R55  32.4K  [R0603]  95.5,31.88 90 top
R56  30.1K  [R0603]  93.34,31.88 270 top
R57  18K  [R0603]  109.09,69.72 180 bottom
R58  432  [R0603]  20.95,76.83 90 bottom
R59  182  [R0603]  20.95,80.01 270 bottom
R60  10K  [R0603]  50.29,40.39 90 top
R61  11.3K  [R0603]  103.38,61.59 90 top
R62  4.7K  [R0603]  95.5,59.56 90 top
R63  4.7K  [R0603]  93.34,59.56 90 top
R64  3.3K  [R0603]  95.25,44.45 270 bottom
R65  4.3K  [R0603]  100.46,44.2 270 bottom
R66  10K  [R0603]  111.76,79.38 270 top
R67  10K  [R0603]  111.76,79.38 90 bottom
R68  10K  [R0603]  104.01,81.28 270 top
R69  61.9K  [R0603]  109.86,76.2 0 bottom
R70  976  [R0603]  109.86,75.95 0 top
R71  0.05  [R0603]  100.2,80.92 90 bottom
R72  0.05  [R0603]  101.35,76.71 90 top
R83  64.9  [R0603]  101.6,9.14 90 top
R84  18  [R0603]  103.63,9.14 90 top
R85  18  [R0603]  105.77,9.14 90 top
R86  64.9  [R0603]  14.61,2.54 180 bottom
R87  18  [R0603]  14.61,5.21 180 bottom
R88  18  [R0603]  14.61,7.37 180 bottom
R89  69.8  [R0603]  67.18,73.79 0 top
R91  69.8  [R0603]  65.53,64.39 180 bottom
R93  1.54K  [R0603]  69.09,59.82 90 bottom
R94  1.54K  [R0603]  67.06,59.82 90 bottom
R95  200K  [R0603]  78.61,49.4 270 bottom
R99  200K  [R0603]  65.02,59.82 270 bottom
R105  84.5  [R0603]  25.65,75.82 180 top
R106  82K  [R0603]  107.19,71.75 0 bottom
R107  18K  [R0603]  89.32,8.26 90 top
R108  82K  [R0603]  86.78,8.26 90 top
R109  10K  [R0603]  81.92,60.33 270 top
R110  4.7K  [R0603]  15.49,22.35 0 top
R111  1.87K  [R0603]  105.41,61.59 90 top
R112  18K  [R0603]  108.97,69.72 0 top
R113  82K  [R0603]  107.31,71.75 180 top
R114  18K  [R0603]  96.69,8.26 90 top
R115  82K  [R0603]  98.85,8.26 90 top
R116  32.4K  [R0603]  97.66,31.88 90 top
R117  30.1K  [R0603]  99.82,31.88 270 top
R119  10K  [R0603]  15.24,10.51 90 top
R120  105  [R0603]  55.88,87 0 top
R121  10K  [R0603]  98.7,78.13 180 top
R122  10K  [R0603]  13.21,10.52 90 top
R123  10K  [R0603]  11.18,10.52 90 top
R124  10K  [R0603]  100.58,16.38 0 bottom
R125  10K  [R0603]  100.58,14.35 0 bottom
R126  10K  [R0603]  100.58,12.32 0 bottom
R127  68  [14-SOIC_CTS]  83.69,36.96 270 top
R128  [14-SOIC_CTS]  72.64,30.61 180 bottom
R129  [14-SOIC_CTS]  72.52,40.51 180 bottom
S1  [TACTILE_SWITCH_SMD]  93.6,36.96 90 top
S2  [TACTILE_SWITCH_SMD]  99.31,36.96 270 top
S3  [TACTILE_SWITCH_SMD]  96.9,3.81 180 top
S4  [TACTILE_SWITCH_SMD]  89.28,3.81 0 top
S5  [TACTILE_SWITCH_SMD]  57.78,69.22 270 top
SV1  [MA06-2W]  78.74,77.47 0 top
SV2  [MA05-2]  21.72,7.11 270 top
SV3  MA02-2W  [MA02-2W]  8.26,80.64 0 top
SV4  [MA04-2]  41.19,55.31 90 top
SV5  [MA03-1]  79.38,53.21 0 top
U2  ADXL345  [LGA14]  59.69,44.2 180 top
U3  NL27WZ14  [SOT363]  108.33,65.15 270 bottom
U4  NL27WZ14  [SOT363]  93.13,12.06 0 top
U5  NL27WZ14  [SOT363]  96.01,28.07 180 top
U6  AT91SAM9260  [208-PQFP]  21.02,30.67 0 bottom
U7  AT45DB321D  [8-SOIC]  61.1,54.67 270 top
U$1  LT3507  [38-QFN]  12.7,64.14 270 top
U$2  TB6612FNG  [24-SSOP]  84.45,67.31 180 top
U$3  LTC2952  [20-QFN]  51.44,69.22 180 top
U$4  LTC4412  [6-TSOT23]  38.1,69.34 0 top
U$5  MAX745  [20-SSOP]  57.15,85.09 180 top
U$6  MT48H32M16LF  [54-VFBGA]  14.99,34.8 270 top
U$7  ROBOLOGOSILKSCREEN  [RCLOGO]  93.34,20.45 0 top
U$8  SI5401DC  [1206-8_CHIPFET]  37.97,64.9 0 top
U$9  SI5401DC  [1206-8_CHIPFET]  41.91,68.07 0 top
U$10  SI5401DC  [1206-8_CHIPFET]  46.1,68.45 90 bottom
U$11  SI5401DC  [1206-8_CHIPFET]  46.1,72.77 270 top
U$12  SI5401DC  [1206-8_CHIPFET]  41.4,72.64 270 top
U$19  IRF7303  [8-SOIC]  57.15,81.92 90 bottom
U$20  MICRO-SD  [MICRO_SD]  84.62,0.91 0 top
U$21  DP83848J  [40-LLP]  48.01,27.05 270 bottom
U$23  MCP1702  [SOT23]  24.13,81.92 0 top
U$26  DS2786  [10-TDFN]  28.57,80.01 90 top
U$27  TB6612FNG  [24-SSOP]  77.47,67.31 180 bottom
U$28  LISY300ALSMD  [LGA28]  48.64,41.15 180 bottom
U$29  AVR_SPI_PRG_6PTH  [2X3]  104.14,53.98 0 top
U$30  AT86RF231  [32-QFN]  91.69,50.04 0 bottom
U$31  CC2591  [16-QFN]  100.84,48.9 180 bottom
U$32  LED-TRICOLOR-THROUGHHOLE  [LED-TRICOLOR-THROUGHHOLE]  10.79,4.83 90 top
U$33  A4983  [28-QFN]  104.78,80.64 270 bottom
U$34  LED-TRICOLOR-THROUGHHOLE  [LED-TRICOLOR-THROUGHHOLE]  104.14,3.81 0 top
U$35  PCA9306  [TSSOP8]  67.82,53.98 90 bottom
U$36  PCA9306  [TSSOP8]  77.85,49.53 0 top
U$38  1.5nH  [0603]  105.79,47.24 90 top
X1  MINI-USB-UX60-MB-5S8  [UX60-MB-5S8]  30.57,1.14 90 top
X2  50MHz  [K25-3C]  47.39,20.55 0 bottom

## Tracks (layer width: path | path; a pad name or v marks a point on that pad's centre or on a via)
3.3V  (via drill 0.38, 0.38 pad 0.3)
  Top 0.152: C34.1 R34.1 R33.1 | C143.1 56.26,23.75 53.98,21.46 v53.21,21.46 | v44.07,29.46 44.58,29.97 45.73,29.97 U$21.1 | R19.2 51.44,62.99 51.31,62.87 50.8,62.87 50.55,62.61 50.55,61.85
  Top 0.254: J1.5 59.94,19.3 J1.4 | v33.27,29.46 33.27,28.42 C99.1 | C85.1 33.34,24.95 v33.4,24.89 | C100.1 33.78,36.37 v33.78,37.47 33.78,38.62 C119.1 | v31.24,17.78 32.37,17.78 C109.1 | v28.57,17.91 27.54,17.91 C86.1 | Q13.5 Q13.4 Q13.5 | Q13.5 16,6.35 16.26,6.1 v18.16,6.1 | Q16.5 v18.16,3.3 | C97.1 17.79,17.91 v18.92,17.91 19.81,18.92 20.19,18.92 21.16,17.95 C98.1 21.94,17.91 v22.99,17.91 | JP2.1 6.35,13.21 v6.99,13.84 7.99,13.84 C110.1 | v37.44,43.56 38.42,43.56 C111.1 | v37.34,41.27 38.41,41.27 C120.1 | Q9.5 99.95,12.19 99.69,11.94 99.69,11.18 v99.95,10.92 | Q8.4 105.04,11.54 104.9,11.68 104.9,12.19 | 104.9,12.19 v104.9,13.72 | Q8.5 104.9,12.19 | R116.1 R55.1 95.5,30.48 v96.01,29.97 | U5.5 96.01,27.56 95.5,28.07 v94.36,28.07 | C36.1 66.29,23.75 v67.56,22.48 67.44,22.35 v62.61,22.35 | R48.1 41.52,23.48 v41.15,23.11 | C76.2 97.37,46.77 v97.54,46.61 C74.2 | C72.1 105.32,49.91 v104.27,49.91 | 57.66,43.06 U2.1 57.7,43.09 C59.1 57.7,39.33 v57.66,39.24 | U2.6 61.69,41.94 61.85,41.78 62.23,41.78 62.45,41.57 C56.1 v63.5,40.39 | U7.3 60.52,54.03 60.71,53.85 60.71,53.59 60.83,53.47 v61.09,53.47 | U$36.2 72.06,49.85 JP1.1 | v50.16,35.69 49.91,35.94 48.73,35.94 C62.1 | R127.14 87.5,31.62 87.88,31.24 v88.39,31.24 | 50.55,61.85 50.29,61.59 41.4,61.59 v41.27,61.47 | C35.1 48.45,21.46 v49.78,21.46 | U7.6 62.54,54.03 61.98,53.47 v61.09,53.47 | U7.5 61.79,52.77 v61.09,53.47
  Top 0.508: C85.1 33.34,28.35 C99.1 | v51.82,29.97 50,29.97 R33.1 | U$20.4 v78.82,10.37 v78.82,10.36
  Bottom 0.152: 49.51,21.46 49.51,22.71 49.07,23.14 49.07,23.6 49.26,23.78 U$21.23 49.28,24.17 49.28,24.51 49.15,24.64 47.88,24.64 47.76,24.52 U$21.26 | 51.69,25.53 52.96,25.53 52.96,25.13 C33.1 | v53.21,21.46 55.03,23.28 R30.1 54.99,23.79 54.99,24.77 54.74,25.02 v54.36,25.02 53.09,25.02 52.58,25.53 51.69,25.53 | U$28.27 47.12,37.87 47.12,38.23 47.37,38.48 47.88,38.48 | 47.88,38.48 48.51,38.48 48.64,38.35 U$28.25 48.6,37.76 C62.1 48.65,36.02 C20.1 | U$28.26 47.88,37.84 47.88,38.48 | U$21.18 51.41,25.8 51.69,25.53 | v44.07,29.46 44.58,29.97 45.73,29.97 U$21.1
  Bottom 0.254: R29.2 59.94,23.71 J1.4 | C37.2 61.21,15.41 J1.5 | X2.1 X2.4 48.52,21.46 v49.78,21.46 | 50.74,21.42 C17.1 50.7,21.46 v49.78,21.46 | U6.187 34.7,28.42 33.66,29.46 v33.27,29.46 | v33.78,37.47 33.83,37.42 U6.169 37.54,37.42 v37.47,37.47 | U6.5 31.77,17.25 v31.24,17.78 | U6.13 27.77,17.1 v28.57,17.91 | v18.92,17.91 18.29,17.27 18.29,15.76 U6.32 | U6.24 22.27,17.19 v22.99,17.91 | U6.52 8.27,14.74 8.13,14.61 7.11,14.61 6.99,14.48 v6.99,13.84 | U6.199 34.99,22.42 33.4,24 v33.4,24.89 | U6.157 37.29,43.42 v37.44,43.56 | U6.160 37.2,41.92 37.34,41.78 v37.34,41.27 | R31.2 67.18,23.75 67.56,23.37 v67.56,22.48 | R32.2 63.08,22.82 v62.61,22.35 | U$31.1 98.21,47.92 98.17,47.88 98.17,46.99 97.79,46.61 v97.54,46.61 | U$31.10 104.21,49.22 104.27,49.28 v104.27,49.91 | U$30.28 91.44,54.11 91.57,54.23 92.46,54.23 92.84,54.61 92.84,54.99 v92.94,55.09 93,55.16 C69.1 | U$30.15 90.44,46.46 90.81,46.1 C68.1 90.34,44.83 v89.66,44.83 | R49.2 R50.2 69.13,47.28 v69.34,47.5 | v61.09,53.47 C132.1 | C20.1 49.91,35.94 v50.16,35.69 | U$35.2 68.14,50.22 68.33,50.04 71.37,50.04 JP1.1 | v41.27,61.47 v41.27,58.42 v41.27,57.53 | v49.78,21.46 49.51,21.46 | R64.2 95.29,43.56 v96.39,43.56 97.5,43.56 C78.1
  Bottom 0.508: D9.1 17.65,53.59 18.03,53.21 24.38,53.21 24.51,53.34 24.51,54.48
  other vias: 27.43,57.4 28.57,57.4 27.43,56.39 28.57,56.39 27.43,55.37 28.57,55.37 27.43,54.48 28.57,54.48 33.02,51.94 34.04,51.94 33.02,52.83 34.04,52.83
  pour Top: 28.57,58.04 34.8,58.04 34.8,51.82 34.42,51.44 34.16,51.18 30.35,51.18 30.23,51.31 30.1,51.44 30.1,53.59 29.97,53.72 29.72,53.98 29.59,54.1 26.92,54.1 26.8,54.23 26.8,57.91 26.92,58.04
  pour Bottom: 23.5,58.67 23.5,54.1 24,53.72 29.21,53.72 29.46,53.98 29.46,58.55 28.96,59.05 23.88,59.05
  pour Power (isolate 0.305): 25.78,62.23 25.78,51.56 27.3,50.04 34.42,50.04 34.54,50.16 34.54,52.83 33.66,53.72 33.66,54.74 34.54,55.63 37.72,55.63 38.48,54.86 38.48,51.31 37.34,50.04 37.34,40.77 31.75,34.8 31.75,31.88 30.1,30.23 30.1,24.89 27.43,22.23 20.83,22.23 20.32,21.72 20.32,16.38 19.3,15.37 1.78,15.37 1.14,14.73 1.14,1.78 1.91,1.02 107.06,0.89 108.08,2.03 108.2,13.46 105.92,14.73 105.92,51.05 104.52,52.45 98.17,52.45 97.66,52.96 97.66,57.78 97.28,58.17 86.23,58.17 85.98,57.78 85.98,53.59 84.45,52.07 66.8,52.07 64.14,54.74 45.59,54.61 37.08,63.12 26.67,63.12
!ACCEL_SPI_CS  (via drill 0.38)
  Top 0.152: v55.88,52.96 56.64,52.96 57.02,53.34 59.82,53.34 59.94,53.21 59.94,52.7 v60.2,52.45 | v63.12,44.2 U2.7
  Bottom 0.152: U6.128 19.77,49.99 20.32,50.55 25.27,50.55 26.29,51.56 31.37,51.56 31.62,51.82 31.62,53.09 32,53.47 34.67,53.47 35.05,53.09 35.05,51.94 35.43,51.56 35.94,51.56 37.97,49.53 44.7,49.53 44.96,49.78 44.96,51.82 45.34,52.2 55.12,52.2 v55.88,52.96 | v60.2,52.45 60.2,44.58 60.58,44.2 v63.12,44.2
!ARM_RST  (via drill 0.38)
  Top 0.152: v16.51,18.67 16.51,21.84 16.38,21.97 16.38,22.31 R110.2
  Top 0.254: v18.03,8.38 21.72,8.38 SV2.6
  Bottom 0.152: U6.36 16.27,17.28 16.51,17.53 v16.51,18.67
  Bottom 0.254: U6.36 16.27,11.93 18.03,10.16 v18.03,8.38
!AVR_RESET  (via drill 0.38)
  Top 0.152: v55.75,15.62 56.01,15.88 67.06,15.88 68.2,17.02 85.34,17.02 88.27,14.1 90.55,14.1 v91.19,13.46 | v94.49,13.84 94.49,18.54 94.74,18.8 103.38,18.8 104.65,20.07 104.65,42.04 v104.9,42.29 | v107.19,51.31 104.65,51.31 102.62,53.34 102.62,53.72 102.49,53.85 JP4.2
  Bottom 0.152: U6.2 33.27,14.36 33.4,14.22 34.42,14.22 36.58,16.38 49.28,16.38 49.66,16.76 54.61,16.76 v55.75,15.62 | v91.19,13.46 94.11,13.46 v94.49,13.84 | v107.19,51.31 106.68,50.8 106.68,48.01 105.16,46.48 105.16,45.97 104.9,45.72 v104.9,42.29
!DEBUG_CS
  Top 0.152: SV4.4 40.96,54.04 41.15,53.85 41.15,52.96 41.27,52.83 43.81,52.83 44.7,51.94 44.7,51.18 44.96,50.93 JP3.3
!FLASH_CS
  Top 0.254: U7.4 57.46,52.77 57.02,52.32 49.15,52.32 48.77,51.94 JP3.2
!FLASH_SPI_CS  (via drill 0.38)
  Top 0.152: v41.4,42.16 41.4,43.56 41.53,43.69 46.48,43.69 46.74,43.94 51.18,43.94 51.31,44.07 51.31,46.99 54.36,50.04 v56.01,50.04
  Bottom 0.152: U6.182 37.9,30.92 38.61,31.62 38.61,32.38 41.27,35.05 43.18,35.05 43.31,35.18 43.31,38.1 42.67,38.73 42.67,39.24 42.16,39.75 40.77,39.75 40.39,40.13 40.39,40.77 41.4,41.78 v41.4,42.16 | JP3.1 55.88,50.93 56.01,50.8 v56.01,50.04
!JTAG_TRST  (via drill 0.38)
  Top 0.254: v18.03,11.18 18.29,10.92 23.75,10.92 24.38,10.29 24.38,4.83 24.13,4.57 SV2.8
  Bottom 0.254: U6.35 16.77,12.44 v18.03,11.18
!PWR_BATT  (via drill 0.38, 0.38 pad 0.3)
  Top 0.152: IC1.43 95.91,71.52 95.5,71.12 v93.73,71.12 | v78.49,69.09 77.98,69.09 74.55,72.52 69.47,72.52 69.22,72.77 69.22,74.8 68.07,75.95 56.64,75.95 v56.13,75.44
  Top 0.254: v50.67,66.17 50.67,66.29 50.94,66.56 U$3.17
  Bottom 0.152: v93.73,71.12 88.52,71.12 87.63,70.23 83.82,70.23 82.68,69.09 v78.49,69.09 | v56.13,75.44 54.86,74.17 54.86,63.12 54.61,62.87 51.56,62.87 51.44,62.99 R20.1
  Bottom 0.254: R20.1 51.44,65.41 v50.67,66.17
!PWR_INT  (via drill 0.38)
  Top 0.152: v32.13,40.89 32.13,43.43 31.37,44.2 31.37,46.1 31.62,46.35 35.18,46.35 37.97,49.15 37.97,60.33 38.23,60.58 48.13,60.58 48.77,61.21 51.31,61.21 51.44,61.34 R19.1 51.44,62.36 51.82,62.74 52.07,62.74 52.7,63.37 v52.7,63.63 | 50.42,71.13 U$3.10 50.44,71.64 v50.93,72.14
  Bottom 0.152: U6.56 7.61,19.42 8.51,20.32 23.62,20.32 24,20.7 24,27.05 24.13,27.18 26.29,27.18 27.05,27.94 27.05,37.72 27.56,38.23 31.11,38.23 32.13,39.24 v32.13,40.89 | v50.93,72.14 50.8,70.87 50.93,70.74 53.09,70.74 54.48,69.34 54.48,66.42 52.7,64.64 v52.7,63.63
!PWR_KILL  (via drill 0.38, 0.38 pad 0.3)
  Top 0.152: IC1.34 100.41,71.19 95.76,66.55 95.76,65.53 95.63,65.41 v94.61,65.41 | v67.56,64.52 62.99,64.52 61.85,65.66 58.67,65.66 v58.42,65.91 | v87.76,60.71 v87.76,63.37
  Bottom 0.152: v94.61,65.41 88.39,65.41 87.76,64.77 v87.76,63.37 | v67.56,64.52 69.98,64.52 74.8,59.69 74.8,57.78 75.31,57.28 85.85,57.28 87.76,59.18 v87.76,60.71 | v58.42,65.91 58.42,64.14 JP5.2
!SDRAM_CAS  (via drill 0.38)
  Top 0.127: v15.49,34.04 14.35,34.04 14.19,33.87 U$6.F4
  Bottom 0.127: U6.104 8.15,43.42 11.18,40.39 17.14,40.39 17.78,39.62 18.03,39.37 18.03,36.58 v15.49,34.04
!SDRAM_CS  (via drill 0.38)
  Top 0.127: 13.34,31.55 U$6.G6 13.21,31.42 13.21,29.72 v13.49,29.44
  Bottom 0.127: U6.103 8.27,42.92 11.05,40.13 16.89,40.13 17.78,39.24 17.78,36.83 16,35.05 15.11,35.05 14.61,34.54 14.61,31.5 14.86,31.24 15.37,31.24 15.75,30.86 15.75,30.1 15.09,29.44 v13.49,29.44
!SDRAM_RAS  (via drill 0.38)
  Top 0.127: U$6.F5 14.19,32.3 14.58,31.9 14.58,31.34 14.43,31.19 14.43,30.33 14.2,30.1 v14.2,28.63
  Bottom 0.127: U6.105 8.27,43.67 11.3,40.64 17.27,40.64 17.91,39.88 18.29,39.5 18.29,35.69 17.14,34.54 17.14,31.5 16.13,30.48 16.13,29.59 15.16,28.63 v14.2,28.63
!SDRAM_WE  (via drill 0.38)
  Top 0.127: v13.34,43.94 13.34,39.8 v13.64,39.5 | 14.22,31.56 U$6.F6 14.17,31.59 14.17,30.76 13.89,30.48 v13.77,30.48
  Bottom 0.127: U6.116 13.77,44.25 v13.34,43.94 | v13.77,30.48 13.77,30.53 14.1,30.86 14.1,34.92 13.59,35.56 13.59,39.45 v13.64,39.5
!VBATT  (via drill 0.38)
  Top 0.152: U$3.13 50.04,69.22 50.29,69.47 50.29,70.36 v49.78,70.87
  Top 0.254: R21.2 36.45,72.86 36.45,71.12 36.92,70.65 U$4.6 37.15,69.91 37.34,69.72 39.88,69.72
  Bottom 0.152: v49.78,70.87 50.29,70.36 50.29,66.8 49.91,66.42 49.78,66.42 49.66,66.29 49.66,64.01 49.4,63.75 42.55,63.75 42.16,64.14 v42.16,65.41
  other vias: 40.26,66.29 40.26,65.41 41.27,66.29 41.27,65.41
  pour Top: 38.86,66.29 38.86,65.15 38.99,65.02 41.15,65.02 41.4,64.77 41.4,62.61 41.66,62.36 42.93,62.36 43.05,62.48 43.05,65.02 42.42,65.66 42.42,70.87 42.8,71.12 42.8,71.75 42.67,71.88 41.53,71.88 41.4,71.75 41.4,70.87 41.27,70.74 40.01,70.74 39.88,70.61 39.88,66.42 38.99,66.42
!VBATT_GATE  (via drill 0.38)
  Top 0.152: U$3.12 49.53,69.72 49.02,69.72 48.34,70.41 v48.34,71.37 | U$9.4 42.9,66.32 v42.93,66.29
  Bottom 0.152: v48.34,71.37 48.26,71.3 48.26,68.83 48.39,68.71 48.77,68.71 48.9,68.58 48.9,64.64 48.39,64.14 43.31,64.14 42.93,64.52 v42.93,66.29
!WL_RST  (via drill 0.38)
  Top 0.152: v38.48,40.13 39.12,40.13 39.5,39.75 42.16,39.75 44.45,37.47 49.28,37.47 49.78,36.96 53.98,36.96 54.1,37.08 54.1,41.53 53.72,41.91 | 53.72,41.91 53.72,45.97 | 53.72,41.91 53.72,48.39 54.36,49.02 56.52,49.02 57.4,49.91 63.37,49.91 63.5,49.78 63.5,46.86 64.77,45.59 v65.02,45.59 | v87.76,47.5 v94.36,47.5
  Bottom 0.152: U6.165 36.88,39.42 37.59,40.13 v38.48,40.13 | v65.02,45.59 68.96,45.59 70.61,47.24 79.12,47.24 80.52,48.64 86.61,48.64 v87.76,47.5 | U$30.8 94.44,47.58 v94.36,47.5 94.36,46.99 95.25,46.1 R64.1
!WL_SPI_CS  (via drill 0.38)
  Top 0.152: v52.12,44.25 53.14,44.25 53.34,44.45 53.34,48.51 54.23,49.4 56.39,49.4 56.77,49.78 56.77,50.16 56.9,50.29 63.63,50.29 63.88,50.04 63.88,47.12 64.77,46.23 v65.91,46.23
  Bottom 0.152: U6.57 7.47,19.92 8.26,20.7 23.37,20.7 23.62,20.95 23.62,27.43 23.75,27.56 26.16,27.56 26.67,28.07 26.67,37.85 27.56,38.73 31.11,38.73 31.75,39.37 31.75,40.13 31.5,40.39 31.5,41.91 33.02,43.43 33.53,43.43 34.8,44.83 35.66,45.7 51.61,45.7 52.12,45.19 v52.12,44.25 | v65.91,46.23 69.09,46.23 70.48,47.62 79.03,47.62 82.7,51.29 U$30.23
+1.8V  (via drill 0.38, 0.38 pad 0.3)
  Top 0.127: U$6.D3 16.2,35.99 16.64,35.99 | 16.64,35.99 16.98,35.99 | 16.98,35.99 U$6.B3 | C125.1 20.72,31.6 U$6.A9 | 18.19,33.25 U$6.A7 21.13,33.2 C123.1 | U$6.C7 16.18,32.79 15.47,32.79 15.06,33.2 U$6.E7 14.58,32.79 13.89,32.79 13.79,32.89 | C123.1 C125.1 | C123.1 C122.1 21.21,35.94 | 21.21,35.94 C121.1 C129.1 | C125.1 C130.1 | 13.79,32.89 13.79,33.91 | 16.98,35.99 21.16,35.99 21.21,35.94 | U$6.J9 11.79,28.09 C126.1 C124.1 | 13.79,32.89 13.79,34.11 14.48,34.8 15.88,34.8 16.26,35.18 16.26,35.61 16.64,35.99
  Top 0.152: 23.92,43.31 C105.1
  Top 0.254: v4.06,28.57 4.06,29.81 C87.1 | v4.06,22.48 4.06,23.78 C95.1 | v3.94,35.31 3.94,36.28 C101.1 | v33.66,34.67 33.66,33.19 C106.1 | v33.78,20.45 33.78,21.4 C117.1 35.02,21.69 35.31,21.97 35.31,29.59 34.8,30.1 32.26,30.1 32.13,30.23 27.69,30.23 | v15.75,17.91 14.5,17.91 C118.1 | v22.73,43.31 23.92,43.31 | v20.45,47.62 21.55,47.62 C103.1 23.5,47.66 C47.1 | C102.1 13.88,47.66 v13.97,47.75 | R7.1 5.84,64.14 5.33,64.64 2.92,64.64 v2.79,64.77 | v29.46,32.51 27.69,30.73 27.69,30.23 | 27.69,30.23 27.69,27.56 26.8,26.67 19.43,26.67 v18.92,26.16 | R110.1 14.64,23.15 14.86,23.37 16,23.37 16.13,23.5 v16.13,24.89
  Top 0.508: C105.1 25.82,43.25 C107.1 C108.1 30.25,43.31 C112.1 30.29,43.31 v31.37,43.31
  Top 1.016: 12.7,28.07 C124.1 8.51,28.07 v8.13,27.69 | v21.21,41.66 C129.1 21.21,28.95 21.08,28.83 21.08,28.19
  Bottom 0.254: U6.77 4.1,29.92 C87.1 4.03,28.61 v4.06,28.57 | U6.65 4.14,23.92 C95.1 4.04,22.51 v4.06,22.48 | U6.90 3.99,36.42 C101.1 3.9,35.34 v3.94,35.31 | 33.9,34.92 U6.174 | 33.9,34.92 v33.66,34.67 | U6.203 33.81,20.42 v33.78,20.45 | U6.38 15.27,17.43 v15.75,17.91 | v22.73,43.31 21.97,43.31 21.77,43.51 U6.132 21.77,46.81 20.95,47.62 v20.45,47.62 | U6.147 29.27,44.65 30.1,43.81 | v31.37,43.31 30.61,43.31 30.1,43.81 | U6.148 29.77,44.15 30.1,43.81 | U6.155 v33.27,44.2 | U6.114 12.77,47.6 C102.1 13.88,47.66 v13.97,47.75 | v2.79,64.77 2.92,64.64 2.92,60.07 3.81,59.18 v3.81,55.37 | 33.9,34.92 33.9,33.27 33.66,33.02 29.97,33.02 v29.46,32.51
  other vias: 3.81,54.48 3.81,53.59 4.7,53.59 4.7,54.48 4.7,55.37 5.59,53.59 6.6,53.59 16.13,26.16 17.53,26.16 17.53,24.89 18.92,24.89
  pour Top: 6.86,59.82 9.65,59.82 10.29,59.31 10.29,50.16 9.91,49.91 7.87,49.91 7.75,50.04 7.75,53.21 3.3,53.21 3.05,53.47 3.05,57.91 3.17,58.04 5.08,58.04
  pour Power (isolate 0.305): 2.41,57.02 2.29,16.89 3.17,16 18.8,16 19.56,16.76 19.56,26.42 20.7,27.56 26.8,27.56 27.05,27.81 27.05,30.99 28.83,32.77 28.83,36.7 32.38,40.01 34.54,42.55 34.54,49.02 34.16,49.4 26.92,49.4 26.04,50.29 25.15,51.05 25.15,57.78 24.64,58.29 3.68,58.29
  pour Top: 15.75,26.92 15.49,26.67 15.49,24.26 15.62,24.13 19.81,24.13 19.94,24.26 19.94,25.65 21.34,27.05 22.23,27.05 22.35,27.18 22.35,42.04 22.1,42.29 20.57,42.29 20.45,42.16 20.45,40.64 20.07,40.26 19.94,27.43 19.43,26.92
+5V  (via drill 0.38)
  Top 0.152: IC1.64 91.5,64.19 90.93,63.63 | C65.2 90.93,63.63 | C19.2 v79.88,62.36 | C133.1 67.35,54.95 v67.31,54.99 | IC1.62 89.71,65.19 89.41,64.9 v89.41,64.52 89.41,64.01 89.79,63.63 90.93,63.63 | U$1.17 7.49,63.63 6.22,64.9 6.22,69.34 5.97,69.6 5.97,73.53 6.22,73.79 11.68,73.79 11.81,73.91 13.59,73.91 13.84,74.17 14.61,74.17 16.13,72.64 20.19,72.64 20.45,72.39 20.45,71.12 20.7,70.87 v28.83,70.87
  Top 0.203: C82.1 108.35,80.33 C83.1 | v110.11,79.5 110.11,80.22
  Top 0.254: IC1.21 100.19,66.19 C63.1 v99.95,67.44 | C83.1 110.11,80.22 R66.1 | v105.16,71.75 R113.2 | C38.1 82.45,49.2 U$36.6 79.75,49.2 v79.55,49.4 78.87,49.4 78.61,49.66 78.61,51.31 78.11,51.82 v78.11,54.74 | R108.2 86.78,10.2 v87,10.41 | R115.2 98.85,9.99 96.77,12.06 93.09,12.06 | R105.1 27.18,75.82 28.32,74.68 28.45,74.68 v28.83,74.3 | 90.98,70.19 90.98,70.69 89.92,71.75 v89.92,72.01 | 90.98,70.19 IC1.52 | C64.1 90.98,70.19 | R61.1 v103.38,59.69 | U4.5 93.13,12.11 93.09,12.06 | v90.93,12.06 93.09,12.06 | U$2.20 81.86,62.8 82.04,62.61 82.68,62.61 82.93,62.36 82.93,59.69 | 82.93,59.69 82.8,59.56 | R109.2 82.72,59.48 82.93,59.69
  Top 0.508: C19.2 80.56,61.17 80.9,60.83 80.9,59.94 81.37,59.48 R109.2 v81.92,58.29 | R18.2 52.79,62.02 v52.7,62.1 | J5.1 40.11,13.86 v40.51,13.46
  Bottom 0.152: U$33.15 106.28,79.35 106.55,79.63 107.16,79.63 U$33.13 | U$27.20 80.07,62.54 v79.88,62.36 | U$35.6 67.49,55.17 v67.31,54.99
  Bottom 0.203: U$33.13 109.97,79.64 v110.11,79.5
  Bottom 0.254: R69.1 110.7,77.05 110.87,77.22 111.51,77.22 v111.63,77.34 111.76,77.47 R67.1 | R106.2 v105.16,71.75 | D10.1 24.34,69.37 R12.2 25.27,72.39 25.78,72.89 C3.2 | 79.53,49.4 v79.55,49.4 79.55,50.11 79.41,50.25 R95.1 | U$29.2 104.14,59.56 104.01,59.69 v103.38,59.69 | U3.5 108.2,65.15 108.33,65.02 v108.33,63.75
  Bottom 0.508: R99.1 R94.2 R93.2 70.45,60.67 v70.48,60.71 | v52.7,62.1 51.52,62.1 R20.2 | v40.51,13.46 40.51,5.21 41.27,4.45 83.06,4.45 84.58,5.97 84.58,10.03 84.96,10.41 v87,10.41 90.55,10.41 90.93,10.79 v90.93,12.06 90.93,12.45 89.92,13.46 89.92,17.14 91.19,18.41 103.63,18.41 104.27,19.05 104.27,40.77 104.65,41.15 105.28,41.15 106.17,42.04 106.17,46.35 107.57,47.75 107.57,50.29 109.22,51.94 111.38,51.94 112.14,52.7 v112.14,53.72 v112.14,54.61 v112.14,55.5
  other vias: 33.4,73.66 33.4,74.68 28.83,69.72 30.1,69.72 30.1,70.87 28.83,72.01 28.83,73.15 29.84,74.68 30.99,74.68 32.13,74.68 34.54,74.68 34.54,73.66 34.54,72.52 34.54,71.5 34.54,70.36 70.36,73.41 71.75,73.41 70.36,74.68 71.75,74.68 71.12,74.04
  pour Top: 28.32,75.31 35.18,75.31 35.18,69.34 28.45,69.34 28.32,69.47
  pour Bottom: 26.04,74.04 26.04,71.25 27.81,71.25 27.94,71.12 27.94,69.09 28.19,68.83 30.23,68.83 30.35,68.96 30.35,73.66 30.48,73.79 34.04,73.79 34.29,73.53 34.29,69.6 34.42,69.47 35.31,69.47 35.31,75.06 35.05,75.31 29.21,75.31 29.08,75.18 29.08,74.55 28.96,74.42 28.45,74.04
  pour Top: 70.23,77.34 72.01,77.34 72.26,77.09 72.26,73.03 72.14,72.9 70.1,72.9 69.98,73.03 69.98,77.09
  pour Power (isolate 0.305): 21.08,75.31 21.59,75.82 34.8,75.82 35.18,75.44 35.18,67.56 36.2,66.55 41.91,66.55 42.16,66.29 42.16,62.61 42.67,62.1 64.9,62.23 68.2,65.53 68.2,74.04 71.12,76.96 75.06,76.96 75.56,77.47 75.56,79.25 75.82,79.5 77.85,79.5 78.23,79.88 78.36,87.88 78.61,88.14 113.16,88.14 113.92,87.38 113.92,53.47 113.41,52.96 98.55,53.09 98.3,53.34 98.3,58.04 97.54,58.8 86.11,58.8 85.34,58.04 85.22,53.98 84.33,52.96 66.8,52.96 66.42,53.34 64.52,55.37 60.33,55.37 46.35,55.24 37.72,63.75 21.97,63.75 20.95,64.77
ACCES_ADC0  (via drill 0.38 pad 0.3)
  Top 0.152: IC1.61 92.79,65.66 87.5,65.66 85.47,67.69 85.47,71.37 84.96,71.88 84.96,72.39 84.71,72.64 v84.71,73.91
  Bottom 0.152: 84.71,73.79 v84.71,73.91 84.71,74.04 92.86,82.2 J4.14
ACCES_ADC1  (via drill 0.38 pad 0.3)
  Top 0.152: v85.34,73.03 85.34,72.14 85.85,71.63 85.85,67.94 87.76,66.04 90.55,66.04 90.68,66.17 92.8,66.17 IC1.60
  Bottom 0.152: v85.34,73.03 85.34,74.17 93.86,82.56 J4.12
ACCES_DETECT  (via drill 0.38 pad 0.3)
  Top 0.152: IC1.4 94.91,64.3 95,64.39 95.63,64.39 96.77,65.53 v96.77,65.91 | J3.14 96.62,78.39 96.9,78.11 97.83,78.11 R121.2 97.92,78.07 97.92,76.58 96.9,75.56 v95.76,74.3
  Bottom 0.152: v96.77,65.91 96.77,66.93 95.76,67.94 v95.76,74.3
ACCES_PIN0  (via drill 0.38 pad 0.3)
  Top 0.152: IC1.25 v98.86,68.19 v98.86,68.2
  Bottom 0.152: J4.2 98.86,68.39 v98.86,68.21 v98.86,68.2
ACCES_PIN1  (via drill 0.38 pad 0.3)
  Top 0.152: IC1.26 101.47,68.71 100.08,68.71 v99.95,68.83
  Bottom 0.152: J4.1 99.36,69.42 v99.95,68.83
ARM_DBG_BTN0  (via drill 0.38)
  Top 0.152: v39.88,36.07 40.64,35.31 40.64,34.29 42.8,32.13 58.29,32.13 65.15,25.27 95,25.27 95.36,25.64 U5.4
  Bottom 0.152: U6.171 39.53,36.42 v39.88,36.07
ARM_DBG_BUT1  (via drill 0.38)
  Top 0.152: v39.12,35.31 42.67,31.75 58.17,31.75 65.02,24.89 96.14,24.89 96.66,25.41 U5.6
  Bottom 0.152: U6.172 38.51,35.92 v39.12,35.31
ARM_SPI_MISO  (via drill 0.38)
  Top 0.152: U2.12 58.49,46.41 58.42,46.48 v58.17,46.48 55.75,46.48 55.24,45.97 55.24,42.93 55.63,42.55 55.63,34.29 55.37,34.04 45.85,34.04 42.29,37.59 v40.89,37.59 | v85.72,50.16 85.72,52.2 v87.25,53.72 | v66.93,62.36 62.48,62.36 v62.23,62.1
  Bottom 0.152: U6.179 37.12,32.42 40.89,36.2 v40.89,37.59 | v58.17,46.48 58.17,57.78 58.1,57.85 | 58.1,57.85 56.64,59.31 JP8.1 | U$30.20 88.14,49.79 88.01,49.66 86.23,49.66 v85.72,50.16 | v87.25,53.72 84.84,56.13 74.8,56.13 73.66,57.28 73.66,59.31 70.61,62.36 v66.93,62.36 | v62.23,62.1 58.1,57.98 58.1,57.85
ARM_SPI_MOSI  (via drill 0.38)
  Top 0.152: 57.61,45.21 U2.13 57.07,45.3 v56.77,45.59 56.26,45.59 55.63,44.96 55.63,43.18 56.01,42.8 56.01,33.91 55.75,33.66 45.72,33.66 42.67,36.58 42.55,36.7 v41.66,36.7 | v86.74,50.67 86.74,52.07 v88.39,53.72 | v65.79,62.99 62.23,62.99 v61.21,61.98